# Altium project Pi4GPU_v1.PrjPcb (part 1 of 2)
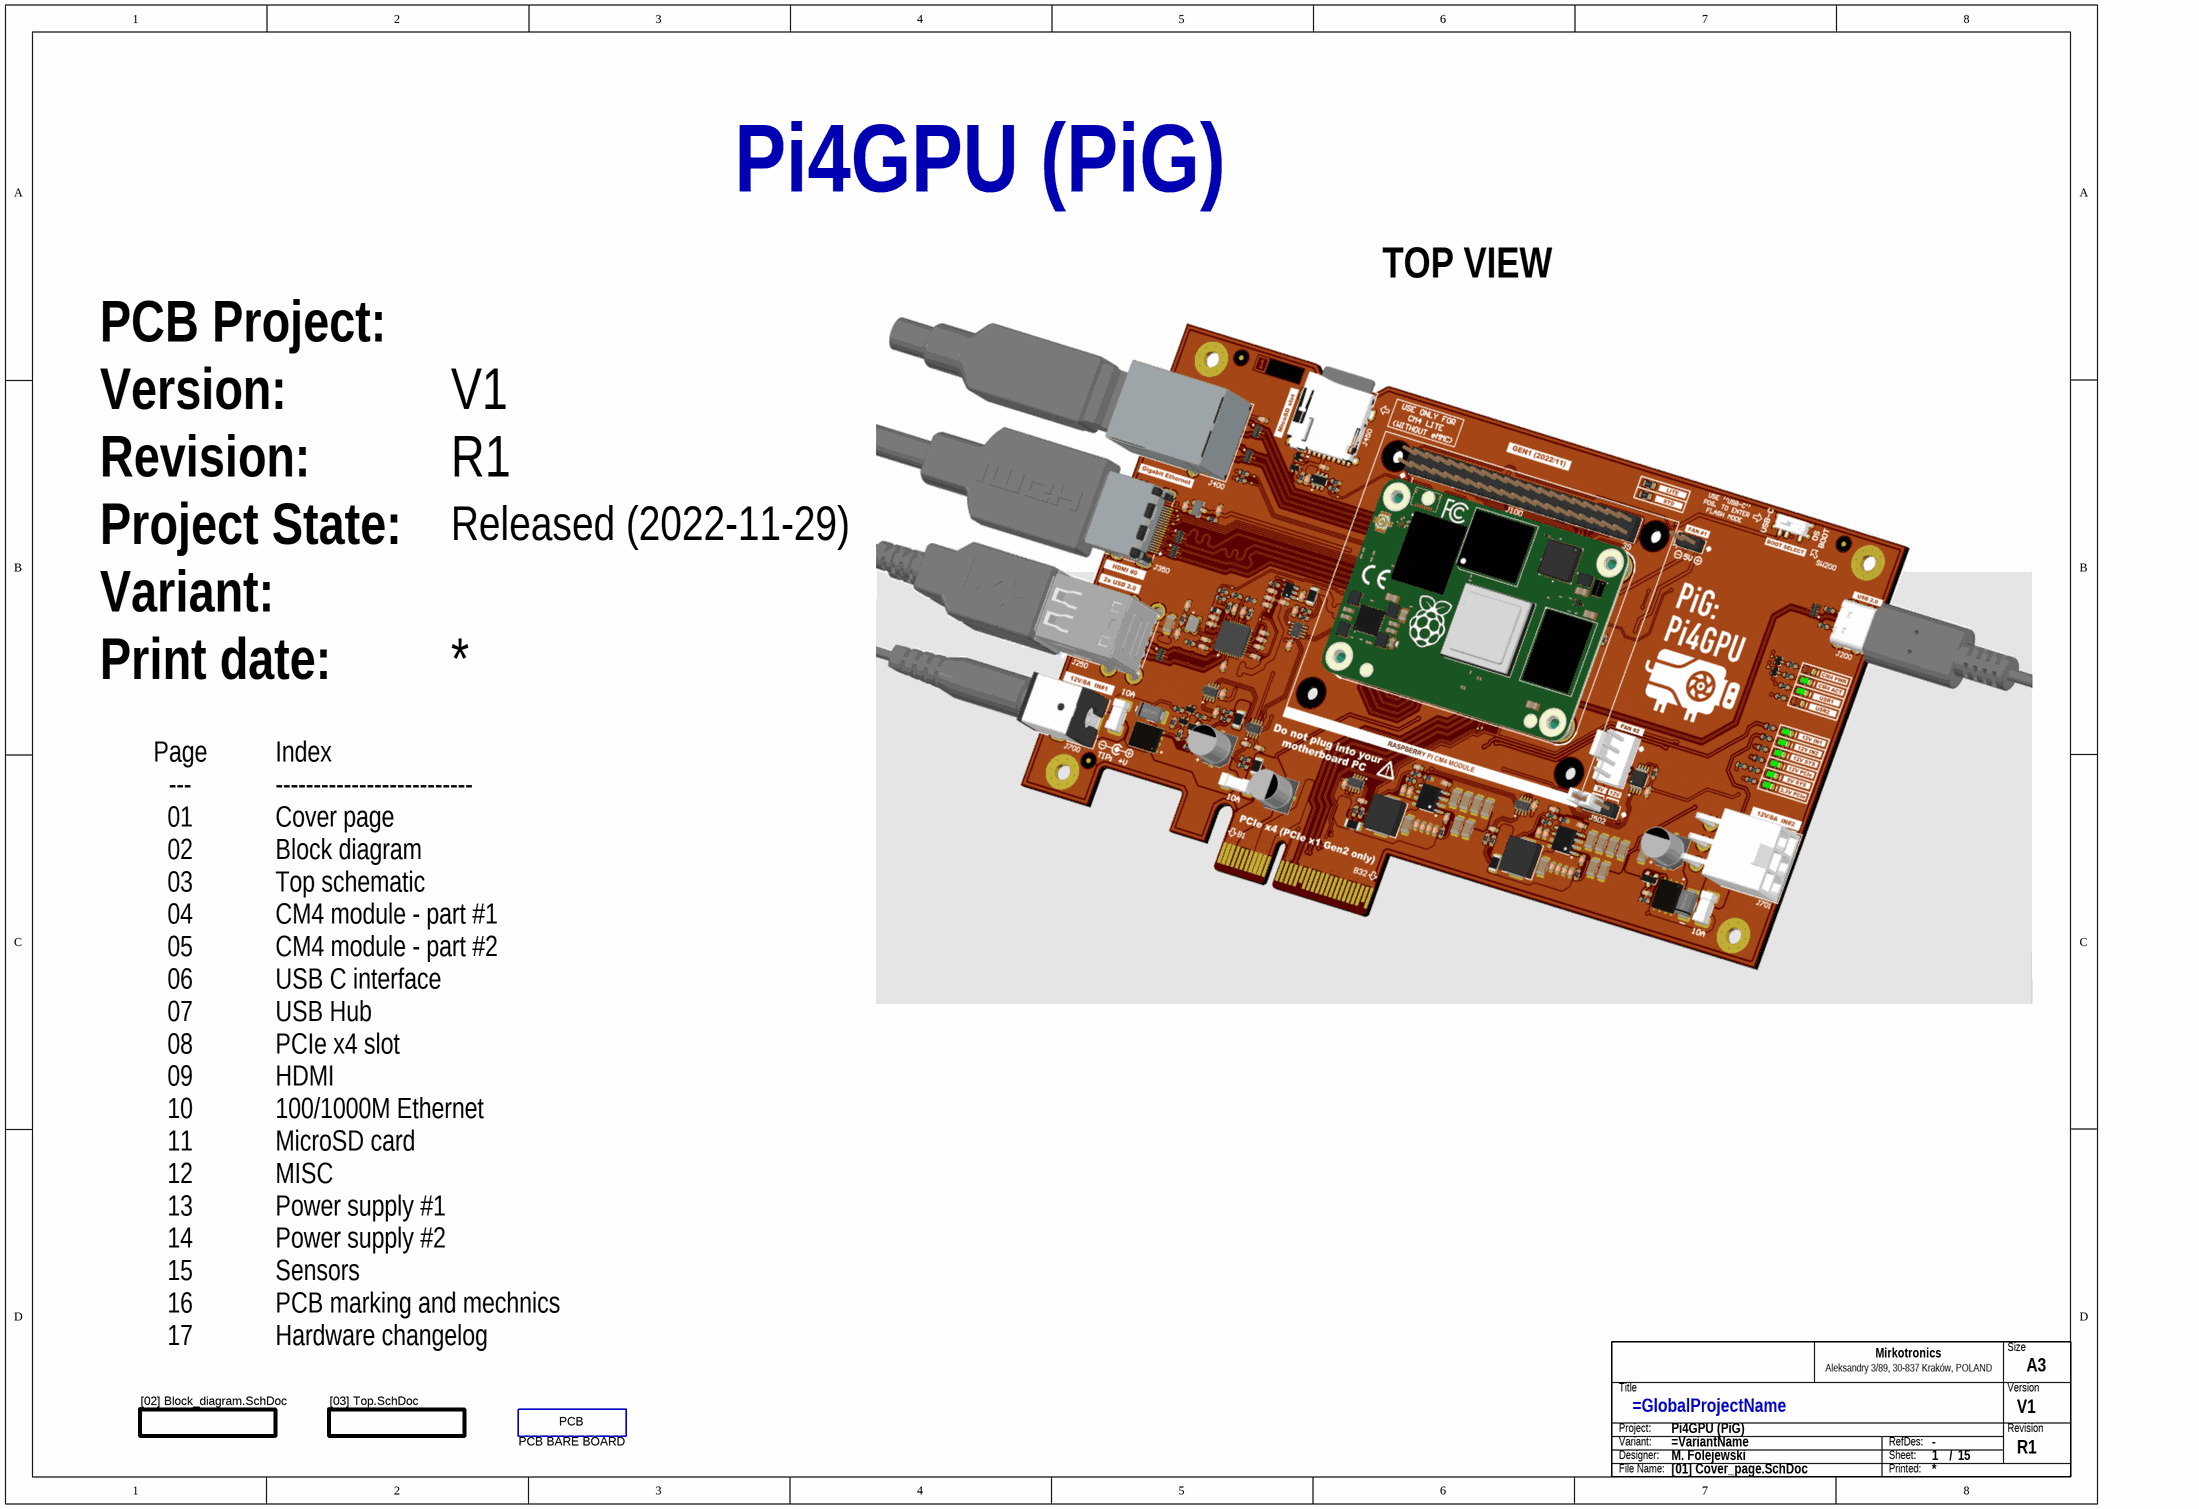
[diagram p0: [01] Cover_page.SchDoc]
GlobalProjectName: Pi4GPU (PiG); OutputFileNamePrefix: Pi4GPU_v1; PCBProjectName: Pi4GPU (PiG); SchPcbReleaseState: Released (2022-11-29); SchPcbRevision: R1; SchPcbVersion: V1
17 sheets, 308 parts. Net scope: global (net labels, ports and power ports of the same name join across sheets).
Board file: Pi4GPU_v1.PcbDoc
Sheets:
  [01] Cover_page.SchDoc
    D8 = [02] Block_diagram.SchDoc
    D9 = [03] TOP.SchDoc
      BLK1 = [04] CM4_PART1.SchDoc
      BLK2 = [05] CM4_PART2.SchDoc
      BLK4 = [08] PCIe.SchDoc
      BLK5 = [06] USB_C.SchDoc
      BLK4 = [10] Ethernet.SchDoc
      BLK4 = [11] SD.SchDoc
      BLK4 = [16] PCB_Mech.SchDoc
      BLK4 = [15] Sensors.SchDoc
      BLK4 = [17] Changelog.SchDoc
      BLK4 = [12] MISC.SchDoc
      BLK4 = [09] HDMI.SchDoc
      BLK4 = [07] USB_HUB.SchDoc
      BLK4 = [13] PWR1.SchDoc
      BLK5 = [14] PWR2.SchDoc

## Sheet [01] Cover_page.SchDoc: =GlobalProjectName
size A3; Engineer: M. Folejewski; DocumentNumber: 1; SheetNumber: 1; SheetTotal: 15; Designators: -; PageSize: A3

### Parts
(Parts that share a designator on the sheet are numbered #1, #2 ... from top to bottom, then left to right.)
PCB1  PCB BARE BOARD  (mechanical)
TB?#1  Title block  (value not drawn)  (graphical)

### Sub-sheets
D8 = [02] Block_diagram.SchDoc: no entries
D9 = [03] Top.SchDoc: no entries

### Notes on the sheet
- TOP VIEW
- PCB Project:
- Version:
- Revision:
- Project State:
- Variant:
- Print date:
- Page
  ---
  01
  02
  03
  04
  05
  06
  07
  08
  09
  10
  11
  12
  13
  14
  15
  16
  17
- Index
  --------------------------
  Cover page
  Block diagram
  Top schematic
  CM4 module - part #1
  CM4 module - part #2
  USB C interface
  USB Hub
  PCIe x4 slot
  HDMI
  100/1000M Ethernet
  MicroSD card
  MISC
  Power supply #1
  Power supply #2
  Sensors
  PCB marking and mechnics
  Hardware changelog
- (in symbol PCB_BARE_BOARD) PCB
- (in symbol SCH_TITLE_BLOCK_MIRKOTRONICS_V2) Size; Mirkotronics; Aleksandry 3/89, 30-837 Kraków, POLAND; Title; Version; Project:; Revision; Variant:; RefDes:; Designer:; Sheet:; /; File Name:; Printed:

### Library data of the parts
PCB1 = PCB_BARE_BOARD: Component Subtype: PCB Board; Component Type: PCB board; Manufacturer: -; MPN: N/A; Value: PCB BARE BOARD; Mounting Type: -; Supplier: ?
TB?#1 = SCH_TITLE_BLOCK_MIRKOTRONICS_V2: Component Type: Title block; Manufacturer: -; Mounting Type: Non component; MPN: -; Operating Temperature: -; Package: -; Specification: Title block; Value: Title block; Replacement: -; System: ?

## Sheet [02] Block_diagram.SchDoc: Block diagram
size A3; Engineer: M. Folejewski; DocumentNumber: 2; SheetNumber: 2; SheetTotal: 15; PageSize: A4; Designators: 1-99
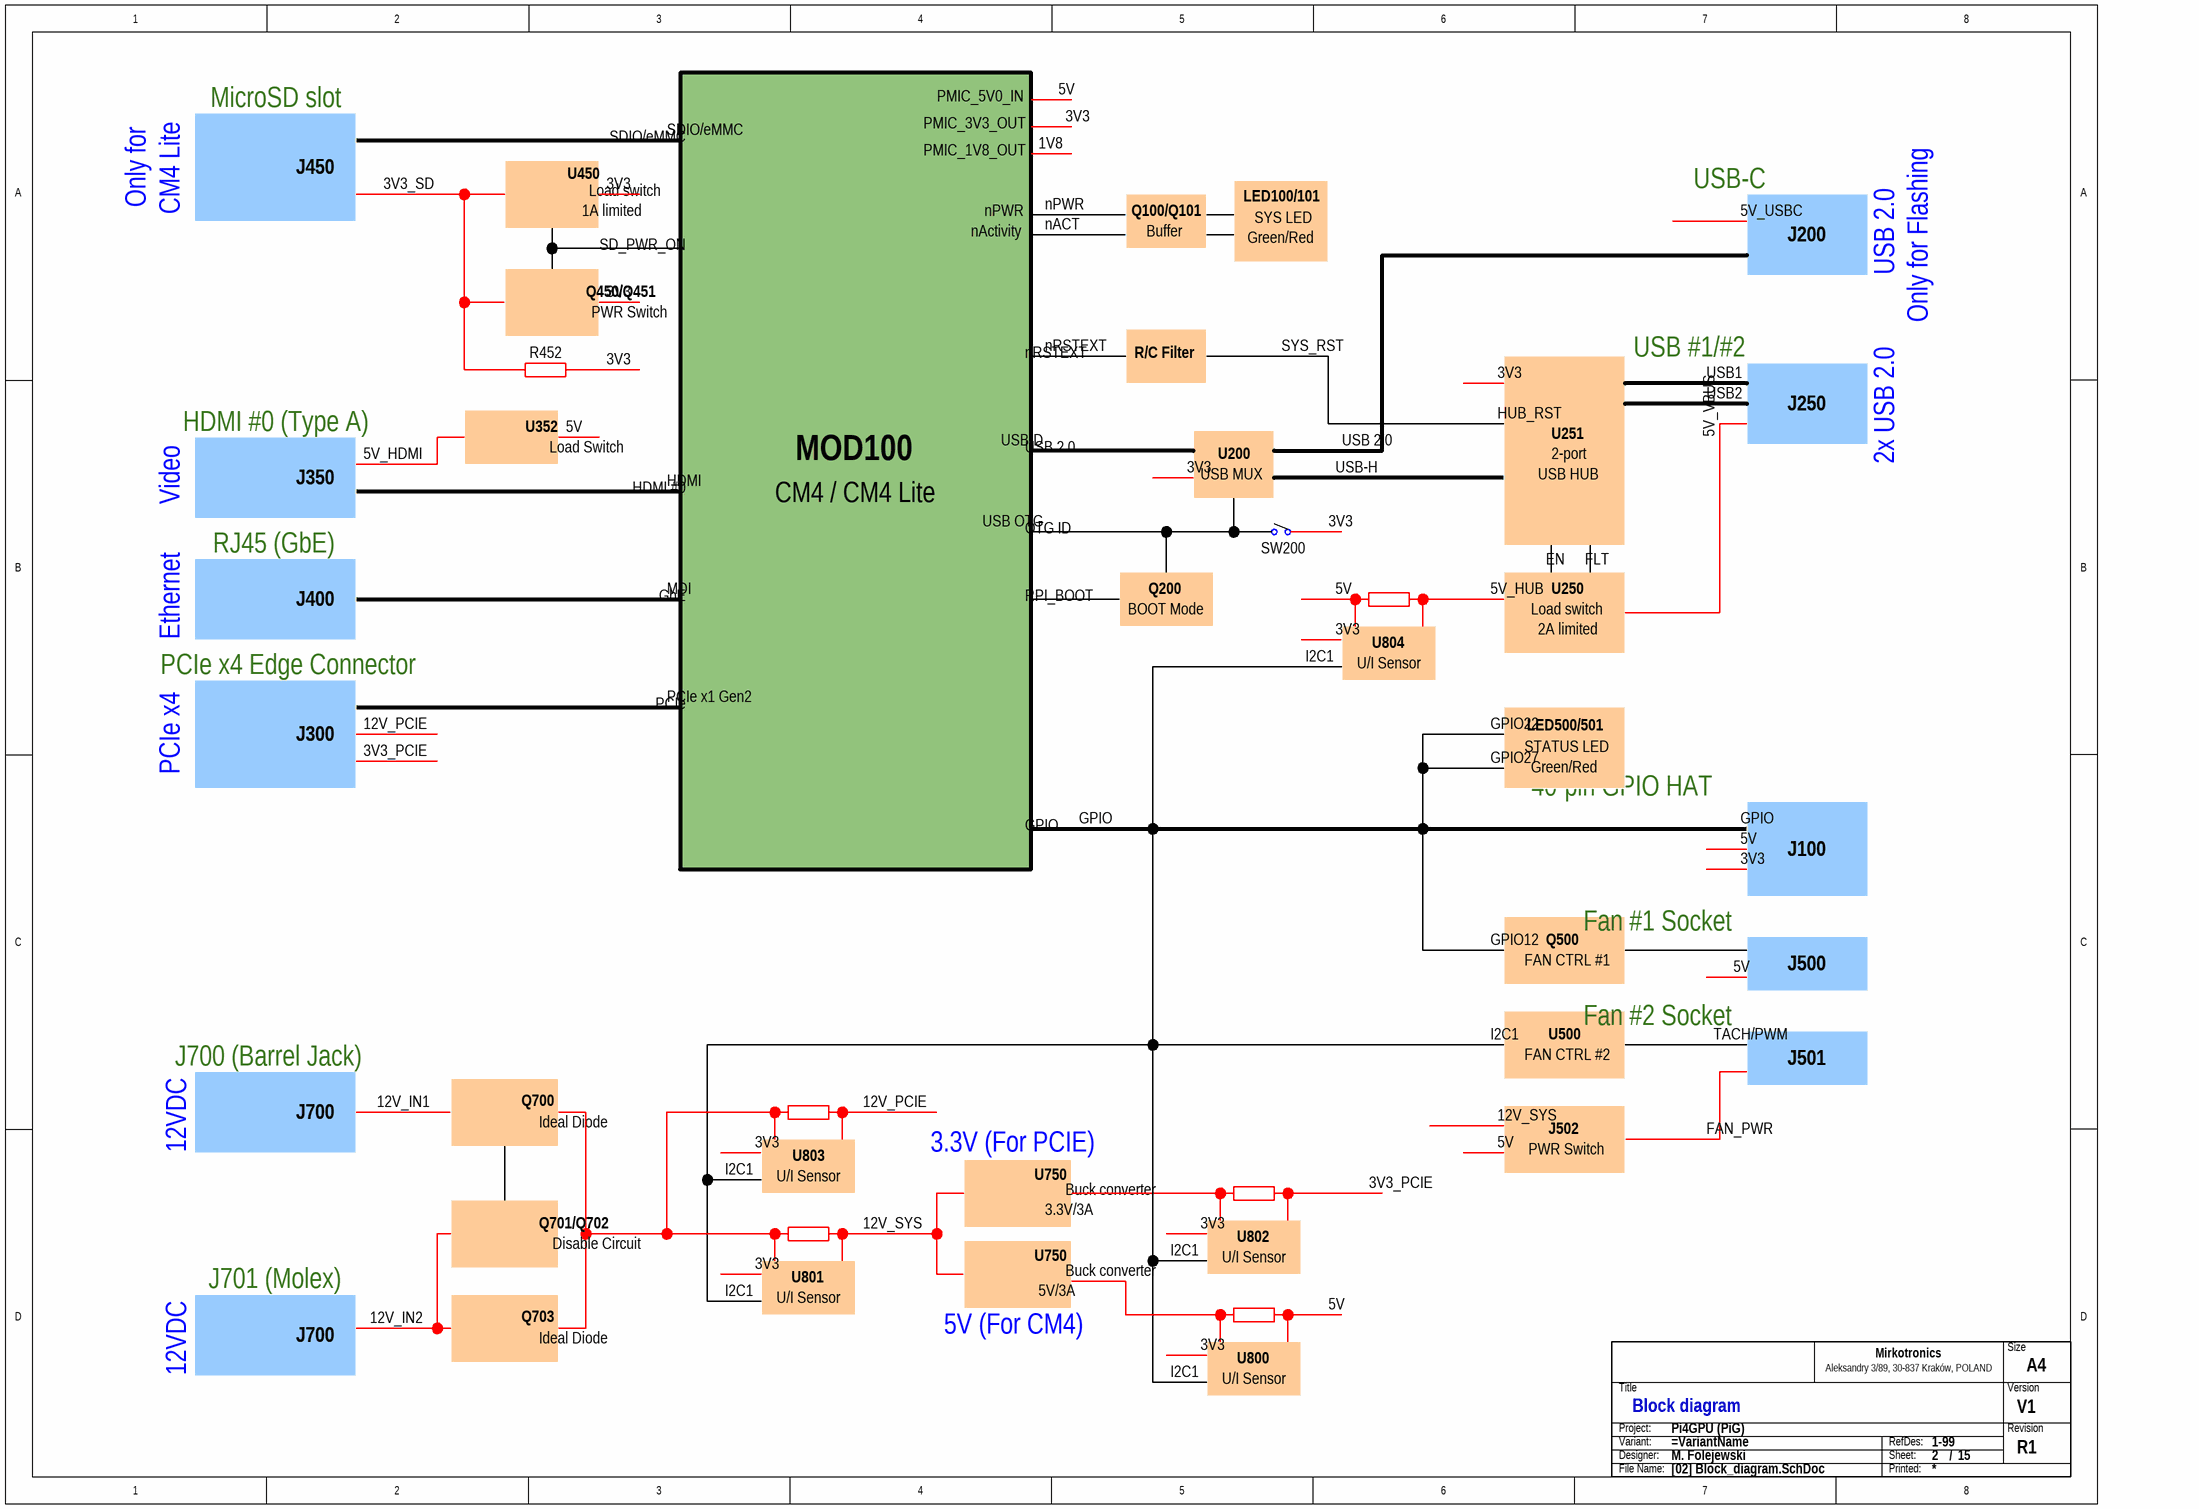
[diagram p1: [02] Block_diagram.SchDoc]

### Parts
(Parts that share a designator on the sheet are numbered #1, #2 ... from top to bottom, then left to right.)
TB?#2  Title block  (value not drawn)  (graphical)

### Notes on the sheet
- MicroSD slot
- PMIC_5V0_IN
- 5V
- J450
- U450
- SDIO/eMMC
- PMIC_3V3_OUT
- PMIC_1V8_OUT
- 1V8
- 3V3
- USB-C
- Only for
- CM4 Lite
- 3V3_SD
- 1A limited
- Load switch
- nActivity
- nPWR
- nACT
- Q100/Q101
- Buffer
- LED100/101
- Green/Red
- SYS LED
- 5V_USBC
- J200
- Q450/Q451
- PWR Switch
- SD_PWR_ON
- USB 2.0
- Only for Flashing
- R452
- nRSTEXT
- R/C Filter
- SYS_RST
- USB1
- USB #1/#2
- HDMI #0 (Type A)
- U352
- Load Switch
- USB-D
- HUB_RST
- U251
- USB2
- 5V_VBUS
- J250
- Video
- J350
- 5V_HDMI
- HDMI
- HDMI #0
- CM4 / CM4 Lite
- MOD100
- USB MUX
- U200
- USB-H
- USB HUB
- 2-port
- 2x USB 2.0
- RJ45 (GbE)
- OTG ID
- USB OTG
- SW200
- EN
- FLT
- Ethernet
- J400
- PCIe x4 Edge Connector
- MDI
- GbE
- RPI_BOOT
- BOOT Mode
- Q200
- U804
- 5V_HUB
- 2A limited
- U250
- PCIe x1 Gen2
- PCIe
- I2C1
- U/I Sensor
- PCIe x4
- J300
- 3V3_PCIE
- 12V_PCIE
- GPIO22
- GPIO27
- STATUS LED
- LED500/501
- 40-pin GPIO HAT
- GPIO
- J100
- Fan #1 Socket
- GPIO12
- FAN CTRL #1
- Q500
- Fan #2 Socket
- J500
- J700 (Barrel Jack)
- U500
- TACH/PWM
- J700
- 12V_IN1
- Q700
- Ideal Diode
- 12V_SYS
- FAN CTRL #2
- J501
- 12VDC
- U803
- 3.3V (For PCIE)
- U750
- J502
- FAN_PWR
- J701 (Molex)
- Q701/Q702
- Disable Circuit
- 3.3V/3A
- Buck converter
- U802
- 12V_IN2
- Q703
- U801
- 5V/3A
- 5V (For CM4)
- U800
- (in symbol SCH_TITLE_BLOCK_MIRKOTRONICS_V2) Size; Mirkotronics; Aleksandry 3/89, 30-837 Kraków, POLAND; Title; Version; Project:; Revision; Variant:; RefDes:; Designer:; Sheet:; /; File Name:; Printed:

### Library data of the parts
TB?#2 = SCH_TITLE_BLOCK_MIRKOTRONICS_V2: Component Type: Title block; Manufacturer: -; Mounting Type: Non component; MPN: -; Operating Temperature: -; Package: -; Specification: Title block; Value: Title block; Replacement: -; System: ?

## Sheet [03] TOP.SchDoc: Top schematic
size A4; Engineer: M. Folejewski; DocumentNumber: 3; SheetNumber: 3; SheetTotal: 15; PageSize: A4; Designators: 1-99
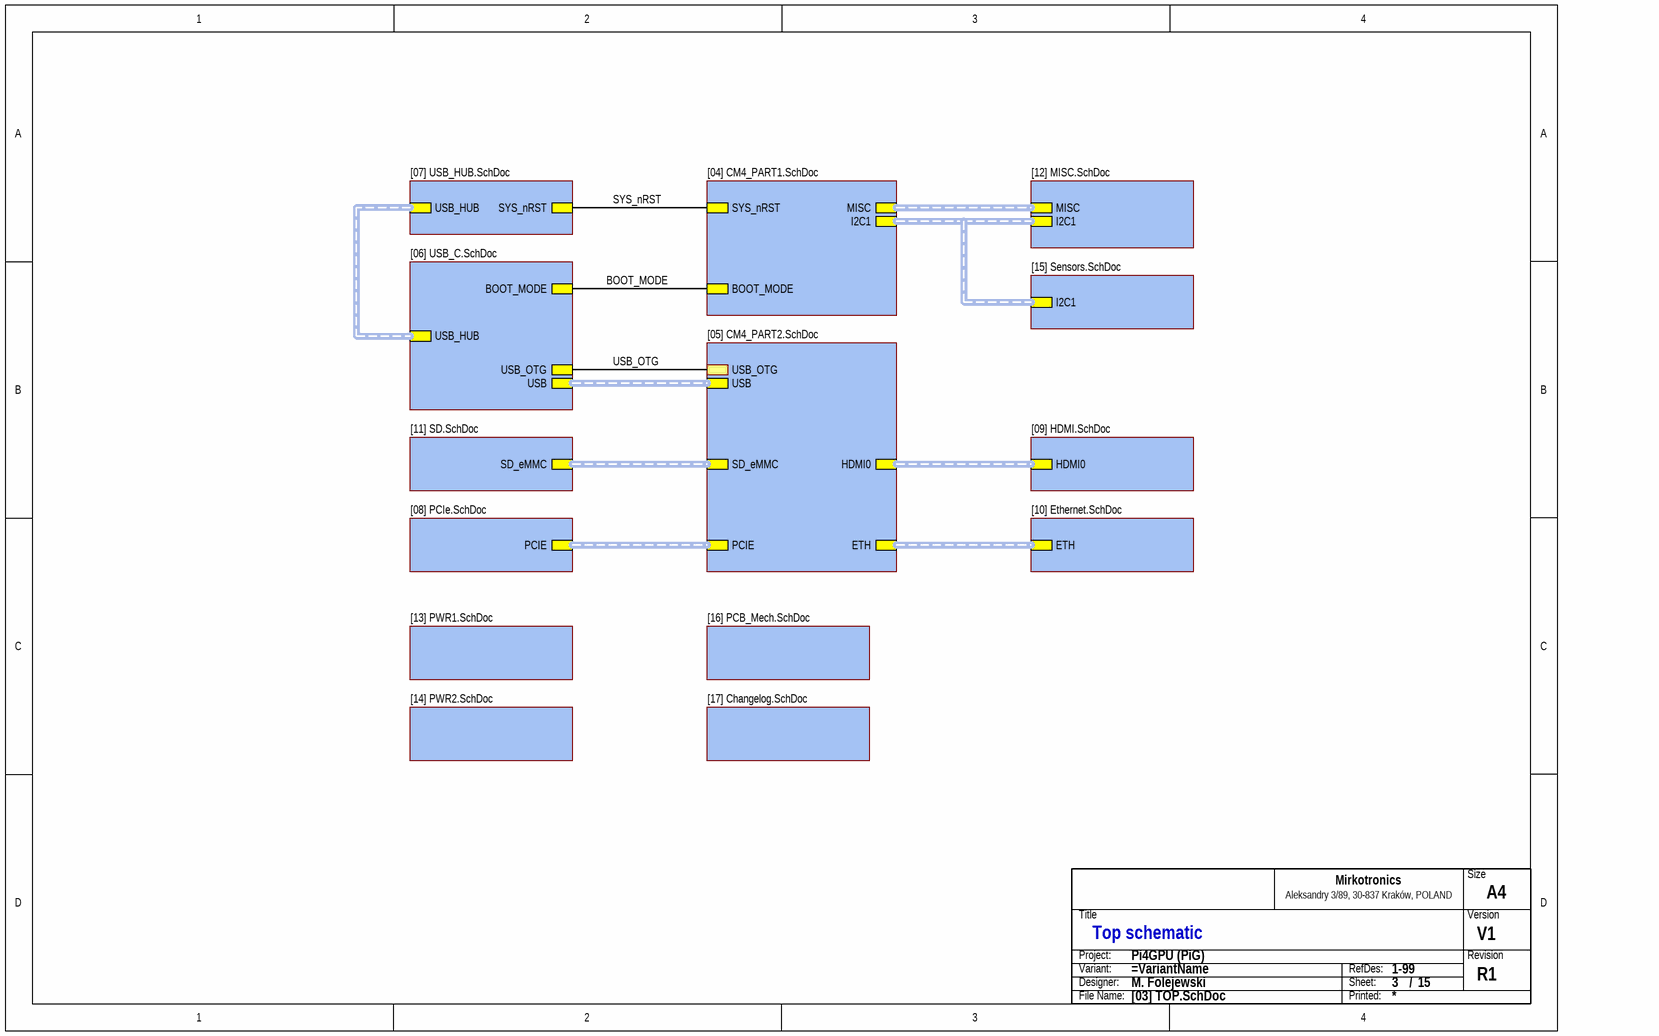
[diagram p2: [03] TOP.SchDoc]

### Parts
(Parts that share a designator on the sheet are numbered #1, #2 ... from top to bottom, then left to right.)
TB?#3  Title block  (value not drawn)  (graphical)

### Sub-sheets
BLK1 = [04] CM4_PART1.SchDoc: BOOT_MODE, MISC (harness MISC), SYS_nRST, I2C1 (harness I2C1)
BLK2 = [05] CM4_PART2.SchDoc: USB (harness USB), PCIE (harness PCIE), SD_eMMC (harness SD_eMMC), USB_OTG, ETH (harness ETH), HDMI0 (harness HDMI)
BLK4 = [08] PCIe.SchDoc: PCIE (harness PCIE)
BLK4 = [10] Ethernet.SchDoc: ETH (harness ETH)
BLK4 = [11] SD.SchDoc: SD_eMMC (harness SD_eMMC)
BLK4 = [16] PCB_Mech.SchDoc: no entries
BLK4 = [15] Sensors.SchDoc: I2C1 (harness I2C1)
BLK4 = [17] Changelog.SchDoc: no entries
BLK4 = [12] MISC.SchDoc: MISC (harness MISC), I2C1 (harness I2C1)
BLK4 = [09] HDMI.SchDoc: HDMI0 (harness HDMI)
BLK4 = [07] USB_HUB.SchDoc: USB_HUB (harness USB_HUB), SYS_nRST
BLK4 = [13] PWR1.SchDoc: no entries
BLK5 = [06] USB_C.SchDoc: USB (harness USB), BOOT_MODE, USB_OTG, USB_HUB (harness USB_HUB)
BLK5 = [14] PWR2.SchDoc: no entries

### Nets
BOOT_MODE: sheet BLK1/BOOT_MODE, sheet BLK5/BOOT_MODE
SYS_nRST: sheet BLK1/SYS_nRST, sheet BLK4/SYS_nRST
USB_OTG: sheet BLK2/USB_OTG, sheet BLK5/USB_OTG  [project net CM_USB_OTG]

### Buses and harness runs
harness sheet BLK1/I2C1 = sheet BLK4/I2C1
harness sheet BLK1/MISC = sheet BLK4/MISC
harness sheet BLK2/ETH = sheet BLK4/ETH
harness sheet BLK2/HDMI0 = sheet BLK4/HDMI0
harness sheet BLK2/PCIE = sheet BLK4/PCIE
harness sheet BLK2/SD_eMMC = sheet BLK4/SD_eMMC
harness sheet BLK2/USB = sheet BLK5/USB
harness sheet BLK4/USB_HUB = sheet BLK5/USB_HUB

### Notes on the sheet
- (in symbol SCH_TITLE_BLOCK_MIRKOTRONICS_V2) Size; Mirkotronics; Aleksandry 3/89, 30-837 Kraków, POLAND; Title; Version; Project:; Revision; Variant:; RefDes:; Designer:; Sheet:; /; File Name:; Printed:

### Library data of the parts
TB?#3 = SCH_TITLE_BLOCK_MIRKOTRONICS_V2: Component Type: Title block; Manufacturer: -; Mounting Type: Non component; MPN: -; Operating Temperature: -; Package: -; Specification: Title block; Value: Title block; Replacement: -; System: ?

## Sheet [04] CM4_PART1.SchDoc: Compute Module 4 (Part #1)
size A3; Engineer: M. Folejewski; DocumentNumber: 4; SheetNumber: 4; SheetTotal: 15; PageSize: A3; Designators: 100-199
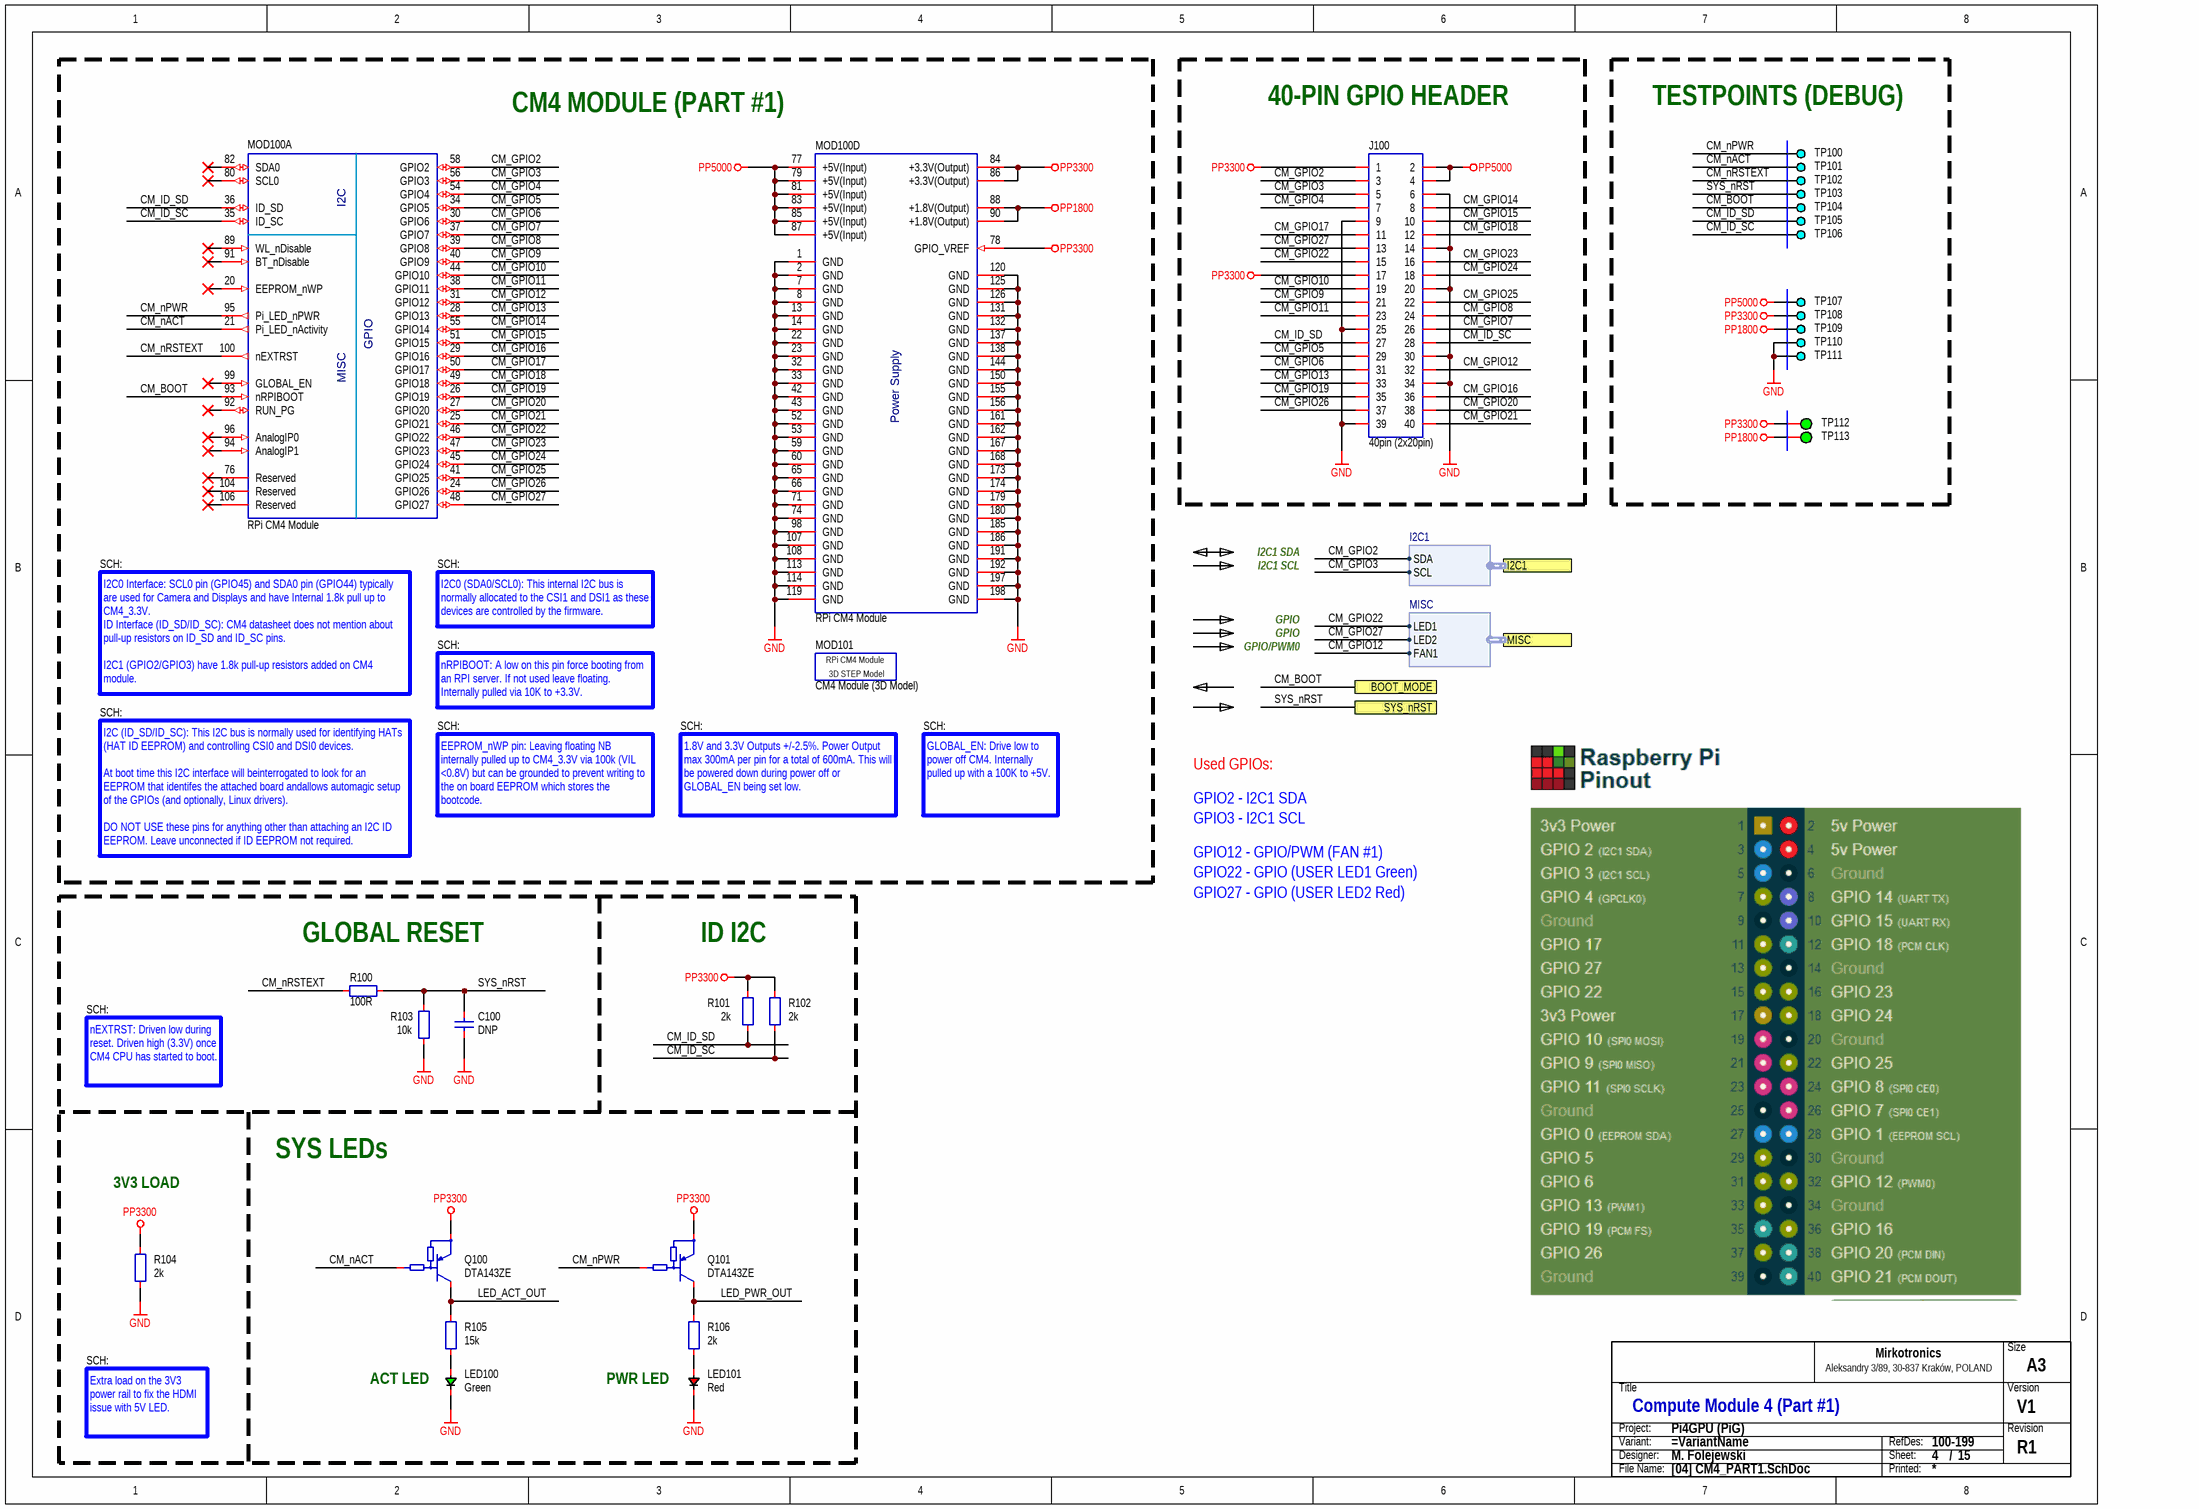
[diagram p3: [04] CM4_PART1.SchDoc]

### Parts
(Parts that share a designator on the sheet are numbered #1, #2 ... from top to bottom, then left to right.)
C100  DNP  [CAP_0603_R]
J100  40pin (2x20pin)  [CON_HDR_P254_2X20M_STR]
LED100  Green  [LED_0805_GRN_R]
LED101  Red  [LED_0805_RED_R]
MOD100  RPi CM4 Module  [MOD_RPI_CM4_SOCKET_P40_C300]  (parts A,D of 4)
MOD101  CM4 Module (3D Model)  [MOD_RPI_CM4_3D_C300_A1]  (no BOM)
Q100  DTA143ZE  [PKG_SOT523_SC75_SOT416_P100_R]
Q101  DTA143ZE  [PKG_SOT523_SC75_SOT416_P100_R]
R100  100R  [RES_0603_R]
R101  2k  [RES_0603_R]
R102  2k  [RES_0603_R]
R103  10k  [RES_0603_R]
R104  2k  [RES_0603_R]
R105  15k  [RES_0603_R]
R106  2k  [RES_0603_R]
TB?#4  Title block  (value not drawn)  (graphical)
TP100  DEBUG  [PCB_TP_DBG_50]  (value not drawn)  (no BOM)
TP101  DEBUG  [PCB_TP_DBG_50]  (value not drawn)  (no BOM)
TP102  DEBUG  [PCB_TP_DBG_50]  (value not drawn)  (no BOM)
TP103  DEBUG  [PCB_TP_DBG_50]  (value not drawn)  (no BOM)
TP104  DEBUG  [PCB_TP_DBG_50]  (value not drawn)  (no BOM)
TP105  DEBUG  [PCB_TP_DBG_50]  (value not drawn)  (no BOM)
TP106  DEBUG  [PCB_TP_DBG_50]  (value not drawn)  (no BOM)
TP107  DEBUG  [PCB_TP_DBG_50]  (value not drawn)  (no BOM)
TP108  DEBUG  [PCB_TP_DBG_50]  (value not drawn)  (no BOM)
TP109  DEBUG  [PCB_TP_DBG_50]  (value not drawn)  (no BOM)
TP110  DEBUG  [PCB_TP_DBG_50]  (value not drawn)  (no BOM)
TP111  DEBUG  [PCB_TP_DBG_50]  (value not drawn)  (no BOM)
TP112  ICT  [PCB_TP_ICT_100]  (value not drawn)  (no BOM)
TP113  ICT  [PCB_TP_ICT_100]  (value not drawn)  (no BOM)

### Ports
BOOT_MODE, I2C1 (harness I2C1), MISC (harness MISC), SYS_nRST

### Harnesses
MISC: LED1, LED2, FAN1
I2C1: SDA, SCL

### Nets
GND: C100.1 J100.6 J100.9 J100.14 J100.20 J100.25 J100.30 J100.34 J100.39 LED100.1 LED101.1 MOD100.1(GND) MOD100.2(GND) MOD100.7(GND) MOD100.8(GND) MOD100.13(GND) MOD100.14(GND) MOD100.22(GND) MOD100.23(GND) MOD100.32(GND) MOD100.33(GND) MOD100.42(GND) MOD100.43(GND) MOD100.52(GND) MOD100.53(GND) MOD100.59(GND) MOD100.60(GND) MOD100.65(GND) MOD100.66(GND) MOD100.71(GND) MOD100.74(GND) MOD100.98(GND) MOD100.107(GND) MOD100.108(GND) MOD100.113(GND) MOD100.114(GND) MOD100.119(GND) MOD100.120(GND) MOD100.125(GND) MOD100.126(GND) MOD100.131(GND) MOD100.132(GND) MOD100.137(GND) MOD100.138(GND) MOD100.144(GND) MOD100.150(GND) MOD100.155(GND) MOD100.156(GND) MOD100.161(GND) MOD100.162(GND) MOD100.167(GND) MOD100.168(GND) MOD100.173(GND) MOD100.174(GND) MOD100.179(GND) MOD100.180(GND) MOD100.185(GND) MOD100.186(GND) MOD100.191(GND) MOD100.192(GND) MOD100.197(GND) MOD100.198(GND) R103.1 R104.1 TP110.1 TP111.1
PP1800: MOD100.88(+1.8V(Output)) MOD100.90(+1.8V(Output)) TP109.1 TP113.1
PP3300: J100.1 J100.17 MOD100.78(GPIO_VREF) MOD100.84(+3.3V(Output)) MOD100.86(+3.3V(Output)) Q100.2(E) Q101.2(E) R101.2 R102.2 R104.2 TP108.1 TP112.1
PP5000: J100.2 J100.4 MOD100.77(+5V(Input)) MOD100.79(+5V(Input)) MOD100.81(+5V(Input)) MOD100.83(+5V(Input)) MOD100.85(+5V(Input)) MOD100.87(+5V(Input)) TP107.1
CM_BOOT: MOD100.93(nRPIBOOT) TP104.1 ; port BOOT_MODE  [project net BOOT_MODE]
CM_GPIO2: J100.3 MOD100.58(GPIO2) ; port I2C1.SDA
CM_GPIO3: J100.5 MOD100.56(GPIO3) ; port I2C1.SCL
CM_GPIO4: J100.7 MOD100.54(GPIO4)
CM_GPIO5: J100.29 MOD100.34(GPIO5)
CM_GPIO6: J100.31 MOD100.30(GPIO6)
CM_GPIO7: J100.26 MOD100.37(GPIO7)
CM_GPIO8: J100.24 MOD100.39(GPIO8)
CM_GPIO9: J100.21 MOD100.40(GPIO9)
CM_GPIO10: J100.19 MOD100.44(GPIO10)
CM_GPIO11: J100.23 MOD100.38(GPIO11)
CM_GPIO12: J100.32 MOD100.31(GPIO12) ; port MISC.FAN1
CM_GPIO13: J100.33 MOD100.28(GPIO13)
CM_GPIO14: J100.8 MOD100.55(GPIO14)
CM_GPIO15: J100.10 MOD100.51(GPIO15)
CM_GPIO16: J100.36 MOD100.29(GPIO16)
CM_GPIO17: J100.11 MOD100.50(GPIO17)
CM_GPIO18: J100.12 MOD100.49(GPIO18)
CM_GPIO19: J100.35 MOD100.26(GPIO19)
CM_GPIO20: J100.38 MOD100.27(GPIO20)
CM_GPIO21: J100.40 MOD100.25(GPIO21)
CM_GPIO22: J100.15 MOD100.46(GPIO22) ; port MISC.LED1
CM_GPIO23: J100.16 MOD100.47(GPIO23)
CM_GPIO24: J100.18 MOD100.45(GPIO24)
CM_GPIO25: J100.22 MOD100.41(GPIO25)
CM_GPIO26: J100.37 MOD100.24(GPIO26)
CM_GPIO27: J100.13 MOD100.48(GPIO27) ; port MISC.LED2
CM_ID_SC: J100.28 MOD100.35(ID_SC) R102.1 TP106.1
CM_ID_SD: J100.27 MOD100.36(ID_SD) R101.1 TP105.1
CM_nACT: MOD100.21(Pi_LED_nActivity) Q100.1(B) TP101.1
CM_nPWR: MOD100.95(Pi_LED_nPWR) Q101.1(B) TP100.1
CM_nRSTEXT: MOD100.100(nEXTRST) R100.1 TP102.1
LED_ACT_OUT: Q100.3(C) R105.2
LED_PWR_OUT: Q101.3(C) R106.2
SYS_nRST: C100.2 R100.2 R103.2 TP103.1 ; port SYS_nRST
NetLED100_2: LED100.2 R105.1
NetLED101_2: LED101.2 R106.1

Not connected (* = marked no-connect by the designer): MOD100 20(EEPROM_nWP)* 76(Reserved)* 80(SCL0)* 82(SDA0)* 89(WL_nDisable)* 91(BT_nDisable)* 92(RUN_PG)* 94(AnalogIP1)* 96(AnalogIP0)* 99(GLOBAL_EN)* 104(Reserved)* 106(Reserved)*

### Notes on the sheet
- 40-PIN GPIO HEADER
- TESTPOINTS (DEBUG)
- (near MOD100) CM4 MODULE (PART #1)
- SCH:
- I2C1 SDA
- I2C1 SCL
- I2C0 (SDA0/SCL0): This internal I2C bus is normally allocated to the CSI1 and DSI1 as these devices are controlled by the firmware.
- GPIO
- GPIO/PWM0
- I2C0 Interface: SCL0 pin (GPIO45) and SDA0 pin (GPIO44) typically are used for Camera and Displays and have Internal 1.8k pull up to CM4_3.3V.
  ID Interface (ID_SD/ID_SC): CM4 datasheet does not mention about pull-up resistors on ID_SD and ID_SC pins.
  I2C1 (GPIO2/GPIO3) have 1.8k pull-up resistors added on CM4 module.
- nRPIBOOT: A low on this pin force booting from an RPI server. If not used leave floating. Internally pulled via 10K to +3.3V.
- Used GPIOs:
- I2C (ID_SD/ID_SC): This I2C bus is normally used for identifying HATs (HAT ID EEPROM) and controlling CSI0 and DSI0 devices.
  At boot time this I2C interface will beinterrogated to look for an EEPROM that identifes the attached board andallows automagic setup of the GPIOs (and optionally, Linux drivers).
  DO NOT USE these pins for anything other than attaching an I2C ID EEPROM. Leave unconnected if ID EEPROM not required.
- EEPROM_nWP pin: Leaving floating NB internally pulled up to CM4_3.3V via 100k (VIL <0.8V) but can be grounded to prevent writing to the on board EEPROM which stores the bootcode.
- 1.8V and 3.3V Outputs +/-2.5%. Power Output max 300mA per pin for a total of 600mA. This will be powered down during power off or GLOBAL_EN being set low.
- GLOBAL_EN: Drive low to power off CM4. Internally pulled up with a 100K to +5V.
- GPIO2 - I2C1 SDA
- GPIO3 - I2C1 SCL
- GPIO12 - GPIO/PWM (FAN #1)
- GPIO22 - GPIO (USER LED1 Green)
- GPIO27 - GPIO (USER LED2 Red)
- GLOBAL RESET
- ID I2C
- nEXTRST: Driven low during reset. Driven high (3.3V) once CM4 CPU has started to boot.
- 3V3 LOAD
- SYS LEDs
- ACT LED
- PWR LED
- Extra load on the 3V3 power rail to fix the HDMI issue with 5V LED.
- (in symbol MOD_CM4_3D_MODEL) RPi CM4 Module
- (in symbol MOD_RPI_CM4_VAR2, part A) I2C; GPIO; MISC
- (in symbol MOD_RPI_CM4_VAR2, part D) Power Supply
- (in symbol SCH_TITLE_BLOCK_MIRKOTRONICS_V2) Size; Mirkotronics; Aleksandry 3/89, 30-837 Kraków, POLAND; Title; Version; Project:; Revision; Variant:; RefDes:; Designer:; Sheet:; /; File Name:; Printed:

### Library data of the parts
C100 = CAP-0018: Capacitor; MLCC; DNP; TBD; TBD; TBD; DO NOT PLACE; SMD; 0603 (1608);; Component Type: Capacitor; Component Subtype: MLCC; Value: DNP; Manufacturer: DNP; MPN: DNP; Mounting Type: SMD; Package (Case): 0603 (1608); Supplier: ?
J100 = CON_2X20_ROW: Connector; 2 Row;; Manufacturer: GENERIC; Component Subtype: Pin Header; MPN: GENERIC; Value: 40pin (2x20pin); Component Type: Connector; Mounting Type: THT; Supplier: ?
LED100 = DIO_LED_GRN: Diode; LED; Green;; Manufacturer: Foshan NationStar Optoelectronics; MPN: NCD0805G1; Component Subtype: LED Diode; Package (Case): 0805 (2012); Value: Green; Component Type: LED; Mounting Type: SMD; Supplier: LCSC
LED101 = DIO_LED_RED: Diode; LED; Red;; Manufacturer: Foshan NationStar Optoelectronics; MPN: NCD0805R1; Component Subtype: LED Diode; Package (Case): 0805 (2012); Value: Red; Component Type: LED; Mounting Type: SMD; Supplier: LCSC
MOD100 = MOD_RPI_CM4_VAR2: PCB Module; RPi Compute Module 4;; Manufacturer: Raspberry Pi Foundation; Component Subtype: Raspberry Pi CM4; MPN: CM4 Module; Value: RPi CM4 Module; Component Type: PCB Module; Mounting Type: -; Supplier: ?
MOD101 = MOD_CM4_3D_MODEL: PCB Module; RPi Compute Module 4; 3D model; Component Subtype: 3D STEP Model; Component Type: PCB Module; Manufacturer: -; Mounting Type: -; MPN: -; Package (Case): -; Supplier: -; Value: CM4 Module (3D Model)
Q100 Q101 = TRA_BJT_PNP_DIG_ONS_DTA143ZE: Transistor; BJT; PNP; Digital (Biased);; Manufacturer: On Semiconductor; MPN: DTA143ZET1G; Component Type: Transistor; Mounting Type: SMD; Value: DTA143ZE
R100 = RES-0026: Resistor; Thick Film; 100R; 1%; 100mW; 100PPM; 75V; Standard; SMD; 0603 (1608);; Manufacturer: Yageo Corporation; MPN: TBD; Component Type: Resistor; Component Subtype: Thick Film; Value: 100R; Mounting Type: SMD; Package (Case): 0603 (1608); Supplier: ?
R101 R102 R104 R106 = RES-0033: Resistor; Thick Film; 2k2; 1%; 100mW; 100PPM; 75V; Standard; SMD; 0603 (1608);; Manufacturer: Yageo Corporation; MPN: TBD; Component Type: Resistor; Component Subtype: Thick Film; Value: 2k; Mounting Type: SMD; Package (Case): 0603 (1608); Supplier: ?
R103 = RES-0028: Resistor; Thick Film; 10k; 1%; 100mW; 100PPM; 75V; Standard; SMD; 0603 (1608);; Manufacturer: Yageo Corporation; MPN: RC0603FR-0710KL; Component Type: Resistor; Component Subtype: Thick Film; Value: 10k; Mounting Type: SMD; Package (Case): 0603 (1608); Supplier: ?
R105 = RES-0043: Resistor; Thick Film; 15k; 1%; 100mW; 100PPM; 75V; Standard; SMD; 0603 (1608);; Manufacturer: Yageo Corporation; MPN: TBD; Component Type: Resistor; Component Subtype: Thick Film; Value: 15k; Mounting Type: SMD; Package (Case): 0603 (1608); Supplier: ?
TB?#4 = SCH_TITLE_BLOCK_MIRKOTRONICS_V2: Component Type: Title block; Manufacturer: -; Mounting Type: Non component; MPN: -; Operating Temperature: -; Package: -; Specification: Title block; Value: Title block; Replacement: -; System: ?
TP100-TP111 = PCB_TP_DBG: PCB Marking; Test Point (Debug);; Value: DEBUG; Component Subtype: -; Component Type: Testpoint; Mounting Type: -; Supplier: ?
TP112 TP113 = PCB_TP_ICT: Test Point (ICT); Specification: Testpoint (for ICT), SMD pad; Component Type: Testpoint (for ICT); Manufacturer: -; Mounting Type: Non component; MPN: -; Value: ICT

## Sheet [05] CM4_PART2.SchDoc: Compute Module 4 (Part #2)
size B; Engineer: M. Folejewski; DocumentNumber: 5; SheetNumber: 5; SheetTotal: 15; PageSize: B; Designators: 100-199
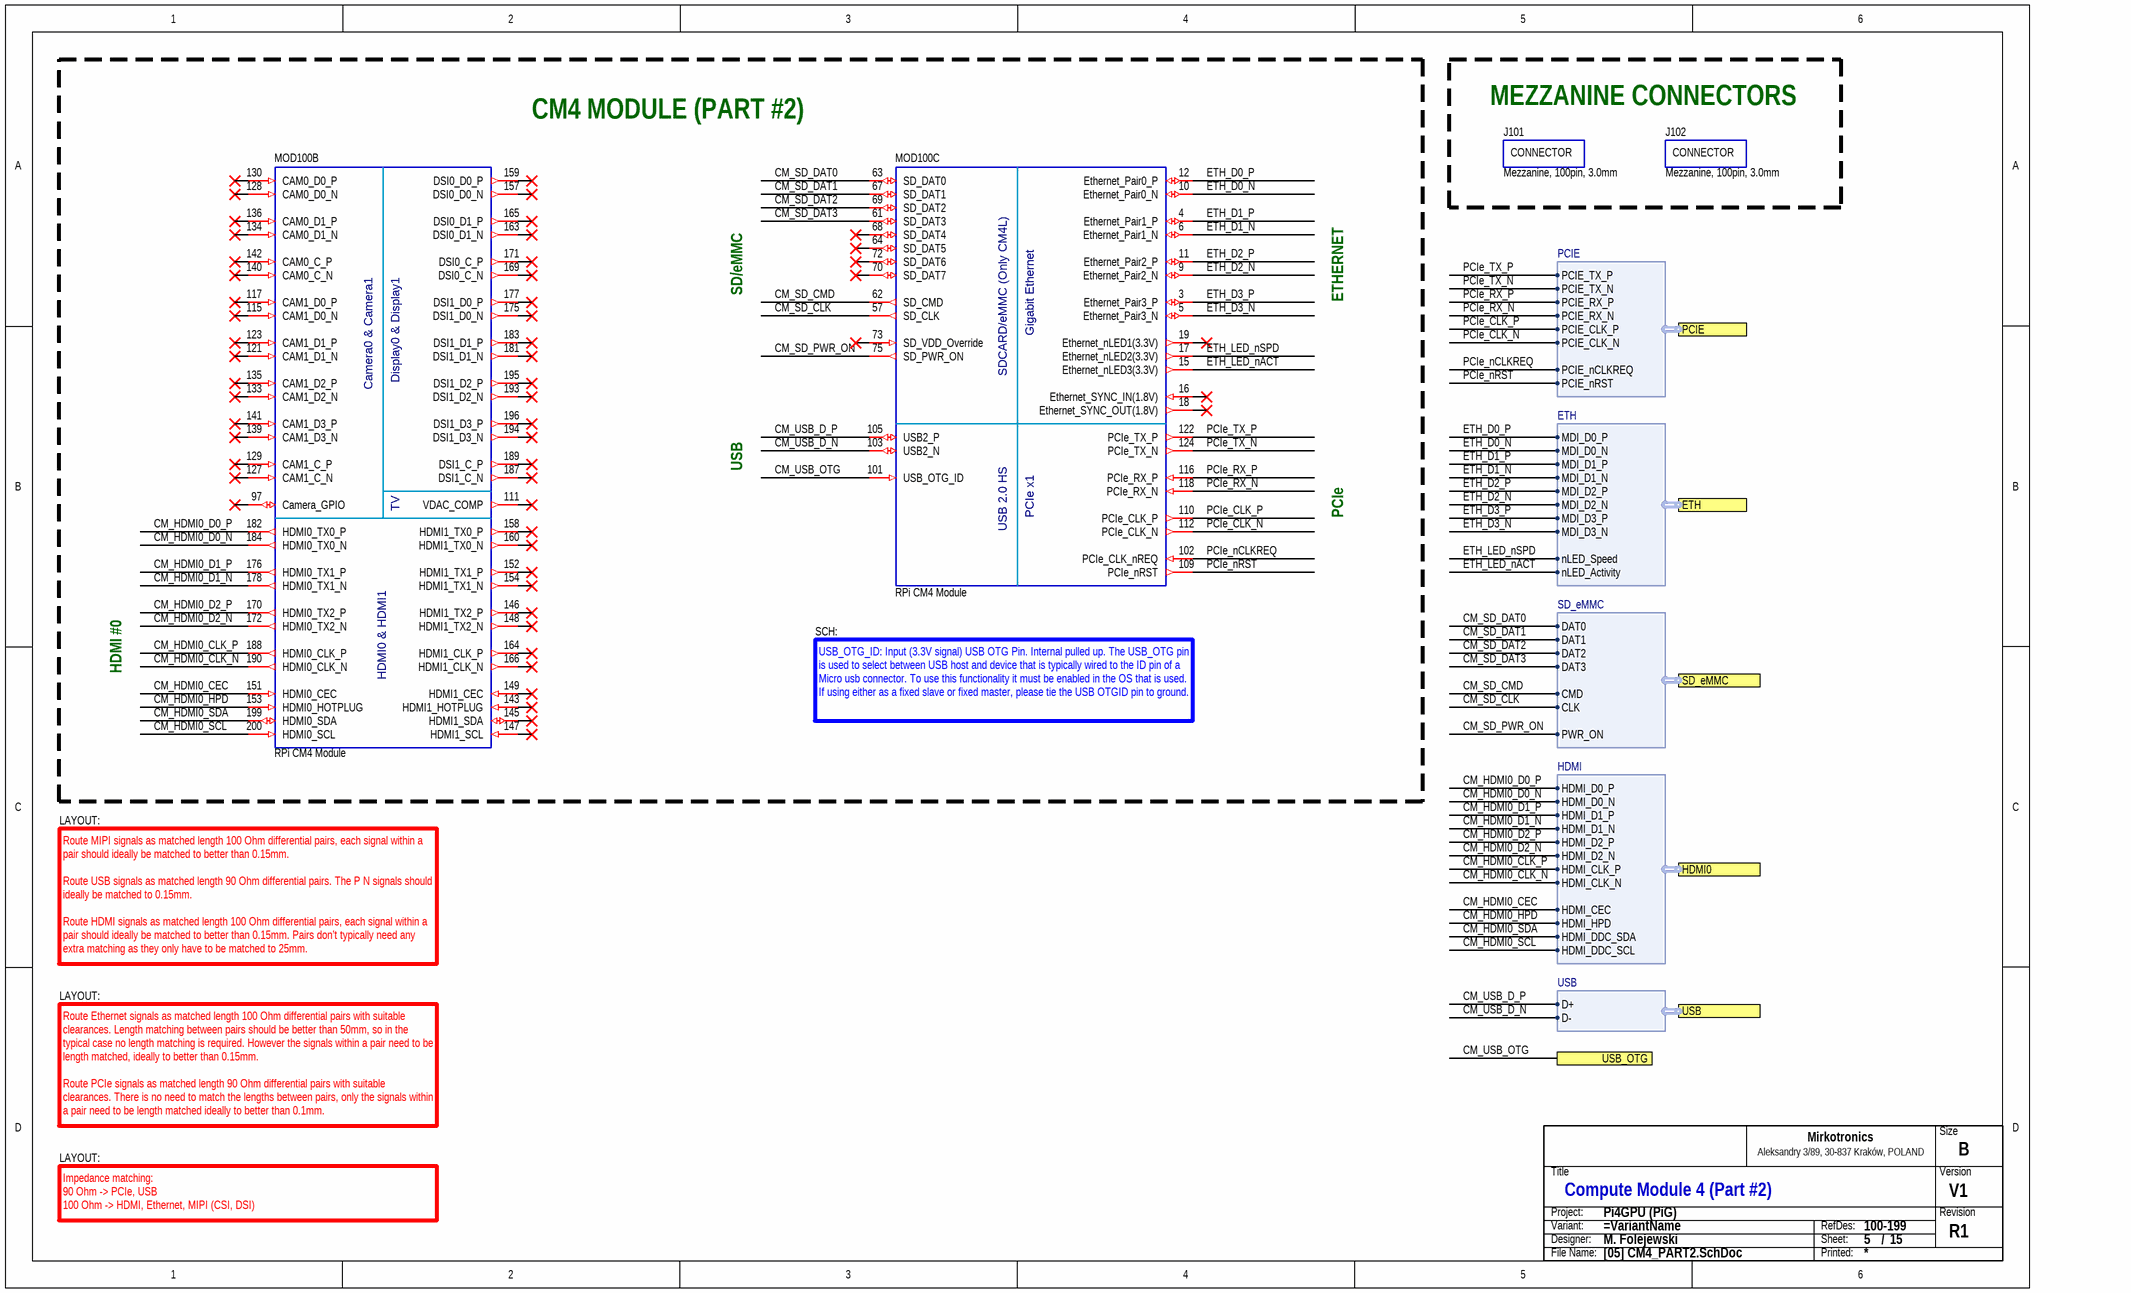
[diagram p4: [05] CM4_PART2.SchDoc]

### Parts
(Parts that share a designator on the sheet are numbered #1, #2 ... from top to bottom, then left to right.)
J101  Mezzanine, 100pin, 3.0mm  [PCB_BLANK_COMP_SMD]
J102  Mezzanine, 100pin, 3.0mm  [PCB_BLANK_COMP_SMD]
MOD100  RPi CM4 Module  [MOD_RPI_CM4_SOCKET_P40_C300]  (parts B,C of 4)
TB?#5  Title block  (value not drawn)  (graphical)

### Ports
ETH (harness ETH), HDMI0 (harness HDMI), PCIE (harness PCIE), SD_eMMC (harness SD_eMMC), USB (harness USB), USB_OTG

### Harnesses
SD_eMMC: DAT0, DAT1, DAT2, DAT3, CMD, CLK, PWR_ON
USB: D+, D-
ETH: MDI_D0_P, MDI_D0_N, MDI_D1_P, MDI_D1_N, MDI_D2_P, MDI_D2_N, MDI_D3_P, MDI_D3_N, nLED_Speed, nLED_Activity
PCIE: PCIE_TX_P, PCIE_TX_N, PCIE_RX_P, PCIE_RX_N, PCIE_CLK_P, PCIE_CLK_N, PCIE_nCLKREQ, PCIE_nRST
HDMI: HDMI_D0_P, HDMI_D0_N, HDMI_D1_P, HDMI_D1_N, HDMI_CEC, HDMI_DDC_SDA, HDMI_D2_P, HDMI_D2_N, HDMI_CLK_P, HDMI_CLK_N, HDMI_DDC_SCL, HDMI_HPD

### Nets
CM_HDMI0_CEC: MOD100.151(HDMI0_CEC) ; port HDMI0.HDMI_CEC
CM_HDMI0_CLK_N: MOD100.190(HDMI0_CLK_N) ; port HDMI0.HDMI_CLK_N
CM_HDMI0_CLK_P: MOD100.188(HDMI0_CLK_P) ; port HDMI0.HDMI_CLK_P
CM_HDMI0_D0_N: MOD100.184(HDMI0_TX0_N) ; port HDMI0.HDMI_D0_N
CM_HDMI0_D0_P: MOD100.182(HDMI0_TX0_P) ; port HDMI0.HDMI_D0_P
CM_HDMI0_D1_N: MOD100.178(HDMI0_TX1_N) ; port HDMI0.HDMI_D1_N
CM_HDMI0_D1_P: MOD100.176(HDMI0_TX1_P) ; port HDMI0.HDMI_D1_P
CM_HDMI0_D2_N: MOD100.172(HDMI0_TX2_N) ; port HDMI0.HDMI_D2_N
CM_HDMI0_D2_P: MOD100.170(HDMI0_TX2_P) ; port HDMI0.HDMI_D2_P
CM_HDMI0_HPD: MOD100.153(HDMI0_HOTPLUG) ; port HDMI0.HDMI_HPD
CM_HDMI0_SCL: MOD100.200(HDMI0_SCL) ; port HDMI0.HDMI_DDC_SCL
CM_HDMI0_SDA: MOD100.199(HDMI0_SDA) ; port HDMI0.HDMI_DDC_SDA
CM_SD_CLK: MOD100.57(SD_CLK) ; port SD_eMMC.CLK
CM_SD_CMD: MOD100.62(SD_CMD) ; port SD_eMMC.CMD
CM_SD_DAT0: MOD100.63(SD_DAT0) ; port SD_eMMC.DAT0
CM_SD_DAT1: MOD100.67(SD_DAT1) ; port SD_eMMC.DAT1
CM_SD_DAT2: MOD100.69(SD_DAT2) ; port SD_eMMC.DAT2
CM_SD_DAT3: MOD100.61(SD_DAT3) ; port SD_eMMC.DAT3
CM_SD_PWR_ON: MOD100.75(SD_PWR_ON) ; port SD_eMMC.PWR_ON
CM_USB_D_N: MOD100.103(USB2_N) ; port USB.D-
CM_USB_D_P: MOD100.105(USB2_P) ; port USB.D+
CM_USB_OTG: MOD100.101(USB_OTG_ID) ; port USB_OTG
ETH_D0_N: MOD100.10(Ethernet_Pair0_N) ; port ETH.MDI_D0_N
ETH_D0_P: MOD100.12(Ethernet_Pair0_P) ; port ETH.MDI_D0_P
ETH_D1_N: MOD100.6(Ethernet_Pair1_N) ; port ETH.MDI_D1_N
ETH_D1_P: MOD100.4(Ethernet_Pair1_P) ; port ETH.MDI_D1_P
ETH_D2_N: MOD100.9(Ethernet_Pair2_N) ; port ETH.MDI_D2_N
ETH_D2_P: MOD100.11(Ethernet_Pair2_P) ; port ETH.MDI_D2_P
ETH_D3_N: MOD100.5(Ethernet_Pair3_N) ; port ETH.MDI_D3_N
ETH_D3_P: MOD100.3(Ethernet_Pair3_P) ; port ETH.MDI_D3_P
ETH_LED_nACT: MOD100.15(Ethernet_nLED3(3.3V)) ; port ETH.nLED_Activity
ETH_LED_nSPD: MOD100.17(Ethernet_nLED2(3.3V)) ; port ETH.nLED_Speed
PCIe_CLK_N: MOD100.112(PCIe_CLK_N) ; port PCIE.PCIE_CLK_N
PCIe_CLK_P: MOD100.110(PCIe_CLK_P) ; port PCIE.PCIE_CLK_P
PCIe_nCLKREQ: MOD100.102(PCIe_CLK_nREQ) ; port PCIE.PCIE_nCLKREQ
PCIe_nRST: MOD100.109(PCIe_nRST) ; port PCIE.PCIE_nRST
PCIe_RX_N: MOD100.118(PCIe_RX_N) ; port PCIE.PCIE_RX_N
PCIe_RX_P: MOD100.116(PCIe_RX_P) ; port PCIE.PCIE_RX_P
PCIe_TX_N: MOD100.124(PCIe_TX_N) ; port PCIE.PCIE_TX_N
PCIe_TX_P: MOD100.122(PCIe_TX_P) ; port PCIE.PCIE_TX_P

Not connected (* = marked no-connect by the designer): MOD100 16(Ethernet_SYNC_IN(1.8V))* 18(Ethernet_SYNC_OUT(1.8V))* 19(Ethernet_nLED1(3.3V))* 64(SD_DAT5)* 68(SD_DAT4)* 70(SD_DAT7)* 72(SD_DAT6)* 73(SD_VDD_Override)* 97(Camera_GPIO)* 111(VDAC_COMP)* 115(CAM1_D0_N)* 117(CAM1_D0_P)* 121(CAM1_D1_N)* 123(CAM1_D1_P)* 127(CAM1_C_N)* 128(CAM0_D0_N)* 129(CAM1_C_P)* 130(CAM0_D0_P)* 133(CAM1_D2_N)* 134(CAM0_D1_N)* 135(CAM1_D2_P)* 136(CAM0_D1_P)* 139(CAM1_D3_N)* 140(CAM0_C_N)* 141(CAM1_D3_P)* 142(CAM0_C_P)* 143(HDMI1_HOTPLUG)* 145(HDMI1_SDA)* 146(HDMI1_TX2_P)* 147(HDMI1_SCL)* 148(HDMI1_TX2_N)* 149(HDMI1_CEC)* 152(HDMI1_TX1_P)* 154(HDMI1_TX1_N)* 157(DSI0_D0_N)* 158(HDMI1_TX0_P)* 159(DSI0_D0_P)* 160(HDMI1_TX0_N)* 163(DSI0_D1_N)* 164(HDMI1_CLK_P)* 165(DSI0_D1_P)* 166(HDMI1_CLK_N)* 169(DSI0_C_N)* 171(DSI0_C_P)* 175(DSI1_D0_N)* 177(DSI1_D0_P)* 181(DSI1_D1_N)* 183(DSI1_D1_P)* 187(DSI1_C_N)* 189(DSI1_C_P)* 193(DSI1_D2_N)* 194(DSI1_D3_N)* 195(DSI1_D2_P)* 196(DSI1_D3_P)*

### Notes on the sheet
- CM4 MODULE (PART #2)
- MEZZANINE CONNECTORS
- SD/eMMC
- ETHERNET
- USB
- PCIe
- SCH:
- HDMI #0
- USB_OTG_ID: Input (3.3V signal) USB OTG Pin. Internal pulled up. The USB_OTG pin is used to select between USB host and device that is typically wired to the ID pin of a Micro usb connector. To use this functionality it must be enabled in the OS that is used. If using either as a fixed slave or fixed master, please tie the USB OTGID pin to ground.
- LAYOUT:
- Route MIPI signals as matched length 100 Ohm differential pairs, each signal within a pair should ideally be matched to better than 0.15mm.
  Route USB signals as matched length 90 Ohm differential pairs. The P N signals should ideally be matched to 0.15mm.
  Route HDMI signals as matched length 100 Ohm differential pairs, each signal within a pair should ideally be matched to better than 0.15mm. Pairs don’t typically need any extra matching as they only have to be matched to 25mm.
- Route Ethernet signals as matched length 100 Ohm differential pairs with suitable clearances. Length matching between pairs should be better than 50mm, so in the typical case no length matching is required. However the signals within a pair need to be length matched, ideally to better than 0.15mm.
  Route PCIe signals as matched length 90 Ohm differential pairs with suitable clearances. There is no need to match the lengths between pairs, only the signals within a pair need to be length matched ideally to better than 0.1mm.
- Impedance matching:
  90 Ohm -> PCIe, USB
  100 Ohm -> HDMI, Ethernet, MIPI (CSI, DSI)
- (in symbol BOM_CON) CONNECTOR
- (in symbol MOD_RPI_CM4_VAR2, part B) Display0 & Display1; Camera0 & Camera1; TV; HDMI0 & HDMI1
- (in symbol MOD_RPI_CM4_VAR2, part C) Gigabit Ethernet; SDCARD/eMMC (Only CM4L); PCIe x1; USB 2.0 HS
- (in symbol SCH_TITLE_BLOCK_MIRKOTRONICS_V2) Size; Mirkotronics; Aleksandry 3/89, 30-837 Kraków, POLAND; Title; Version; Project:; Revision; Variant:; RefDes:; Designer:; Sheet:; /; File Name:; Printed:

### Library data of the parts
J101 J102 = BOM_CON: BOM list; Connector;; Manufacturer: Hirose; MPN: DF40HC(3.0)-100DS-0.4V; Component Subtype: Microminiature; Package (Case): SMD; Value: Mezzanine, 100pin, 3.0mm; Component Type: Connector; Mounting Type: SMD; Supplier: ?
MOD100 = MOD_RPI_CM4_VAR2: as MOD100 on sheet [04] CM4_PART1; Value: RPi CM4 Module; MPN: CM4 Module; Component Type: PCB Module; Mounting Type: -; Supplier: ?
TB?#5 = SCH_TITLE_BLOCK_MIRKOTRONICS_V2: Component Type: Title block; Manufacturer: -; Mounting Type: Non component; MPN: -; Operating Temperature: -; Package: -; Specification: Title block; Value: Title block; Replacement: -; System: ?

## Sheet [08] PCIe.SchDoc: PCIe x4 edge connector (PCIe x1 only)
size A4; Engineer: M. Folejewski; DocumentNumber: 8; SheetNumber: 8; SheetTotal: 15; PageSize: A4; Designators: 300-399
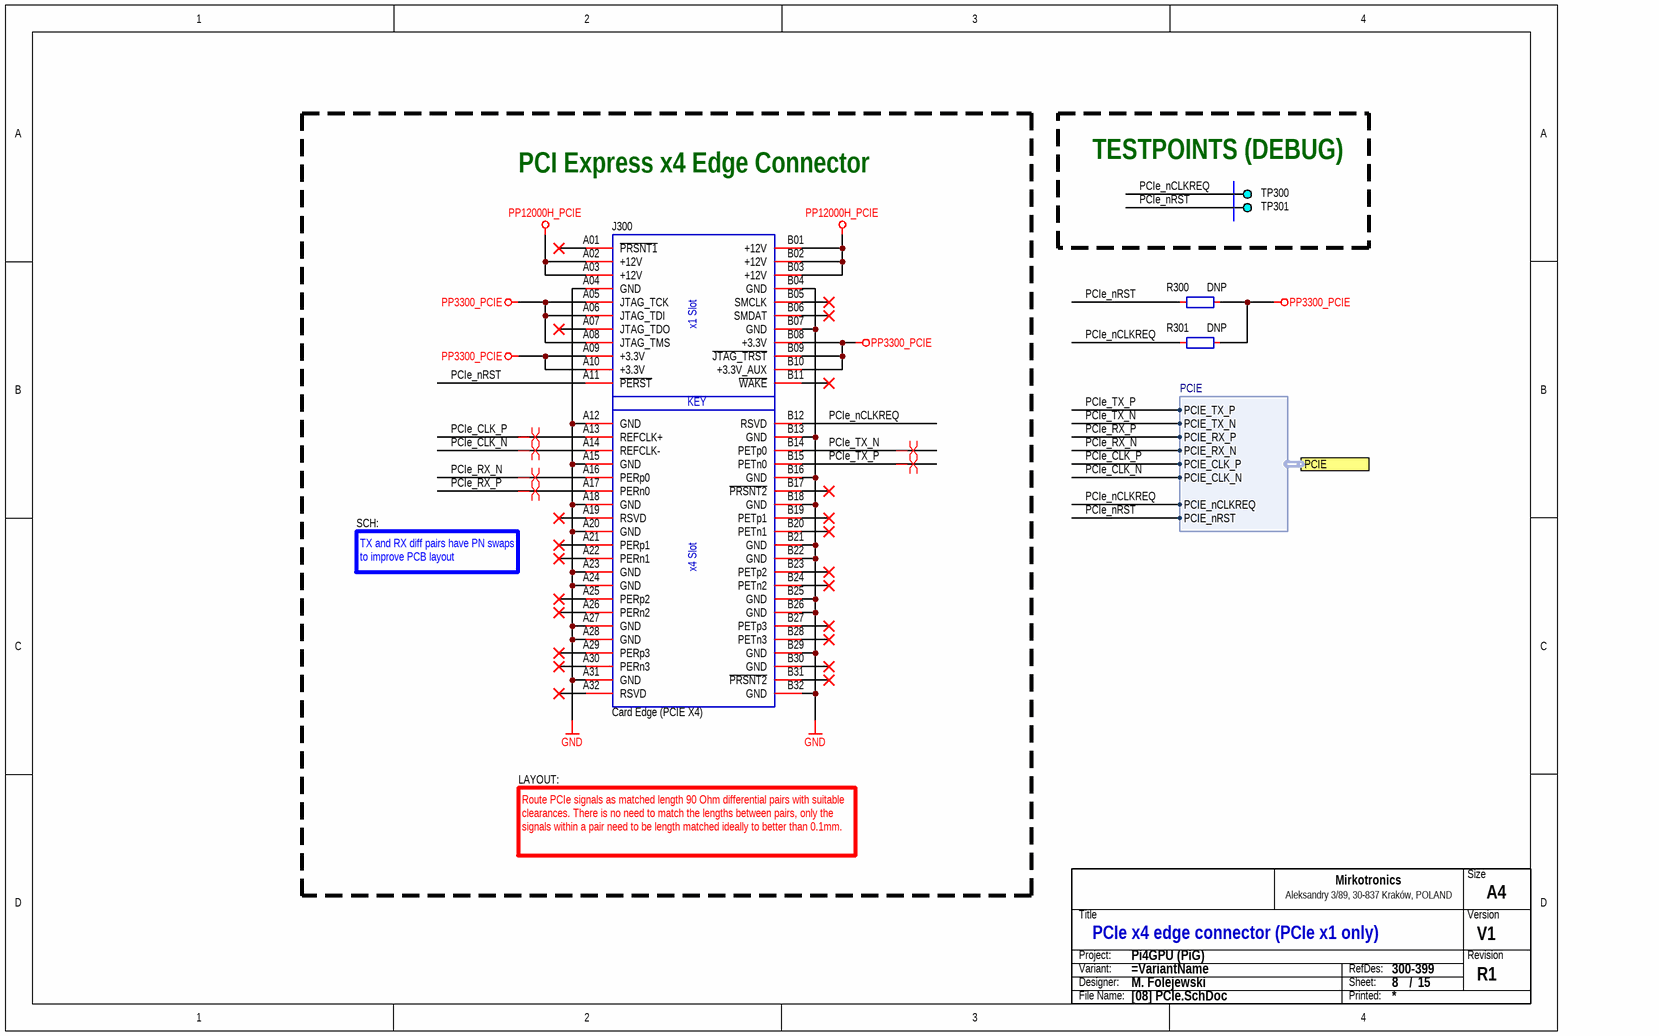
[diagram p5: [08] PCIe.SchDoc]

### Parts
(Parts that share a designator on the sheet are numbered #1, #2 ... from top to bottom, then left to right.)
J300  Card Edge (PCIE X4)  [PCB_CARD_EDGE_PCIE_64P]  (no BOM)
R300  DNP  [RES_0603_R]
R301  DNP  [RES_0603_R]
TB?#6  Title block  (value not drawn)  (graphical)
TP300  DEBUG  [PCB_TP_DBG_50]  (value not drawn)  (no BOM)
TP301  DEBUG  [PCB_TP_DBG_50]  (value not drawn)  (no BOM)

### Ports
PCIE (harness PCIE)

### Harnesses
PCIE: PCIE_TX_P, PCIE_TX_N, PCIE_RX_P, PCIE_RX_N, PCIE_CLK_P, PCIE_CLK_N, PCIE_nCLKREQ, PCIE_nRST

### Nets
GND: J300.A04(GND) J300.A12(GND) J300.A15(GND) J300.A18(GND) J300.A20(GND) J300.A23(GND) J300.A24(GND) J300.A27(GND) J300.A28(GND) J300.A31(GND) J300.B04(GND) J300.B07(GND) J300.B13(GND) J300.B16(GND) J300.B18(GND) J300.B21(GND) J300.B22(GND) J300.B25(GND) J300.B26(GND) J300.B29(GND) J300.B32(GND)
PP3300_PCIE: J300.A05(JTAG_TCK) J300.A06(JTAG_TDI) J300.A08(JTAG_TMS) J300.A09(+3.3V) J300.A10(+3.3V) J300.B08(+3.3V) J300.B09(~{JTAG_T}~{RST}) J300.B10(+3.3V_AUX) R300.1 R301.1
PP12000H_PCIE: J300.A02(+12V) J300.A03(+12V) J300.B01(+12V) J300.B02(+12V) J300.B03(+12V)
PCIe_CLK_N: J300.A14(REFCLK-) ; port PCIE.PCIE_CLK_N
PCIe_CLK_P: J300.A13(REFCLK+) ; port PCIE.PCIE_CLK_P
PCIe_nCLKREQ: J300.B12(RSVD) R301.2 TP300.1 ; port PCIE.PCIE_nCLKREQ
PCIe_nRST: J300.A11(~{PERST}) R300.2 TP301.1 ; port PCIE.PCIE_nRST
PCIe_RX_N: J300.A16(PERp0) ; port PCIE.PCIE_RX_N
PCIe_RX_P: J300.A17(PERn0) ; port PCIE.PCIE_RX_P
PCIe_TX_N: J300.B14(PETp0) ; port PCIE.PCIE_TX_N
PCIe_TX_P: J300.B15(PETn0) ; port PCIE.PCIE_TX_P

Not connected (* = marked no-connect by the designer): J300 A01(~{PRSNT1})* A07(JTAG_TDO)* A19(RSVD)* A21(PERp1)* A22(PERn1)* A25(PERp2)* A26(PERn2)* A29(PERp3)* A30(PERn3)* A32(RSVD)* B05(SMCLK)* B06(SMDAT)* B11(~{WAKE})* B17(~{PRSNT2})* B19(PETp1)* B20(PETn1)* B23(PETp2)* B24(PETn2)* B27(PETp3)* B28(PETn3)* B30(GND)* B31(~{PRSNT2})*

### Layout directives
differential pair: PCIe_CLK_N, PCIe_CLK_P, PCIe_RX_N, PCIe_RX_P, PCIe_TX_N, PCIe_TX_P

### Notes on the sheet
- PCI Express x4 Edge Connector
- TESTPOINTS (DEBUG)
- TX and RX diff pairs have PN swaps to improve PCB layout
- SCH:
- LAYOUT:
- Route PCIe signals as matched length 90 Ohm differential pairs with suitable clearances. There is no need to match the lengths between pairs, only the signals within a pair need to be length matched ideally to better than 0.1mm.
- (in symbol CON_PCIE_64P_VAR2) x1 Slot; KEY; x4 Slot
- (in symbol SCH_TITLE_BLOCK_MIRKOTRONICS_V2) Size; Mirkotronics; Aleksandry 3/89, 30-837 Kraków, POLAND; Title; Version; Project:; Revision; Variant:; RefDes:; Designer:; Sheet:; /; File Name:; Printed:

### Library data of the parts
J300 = CON_PCIE_64P_VAR2: Connector; PCIE, x4 (64pin); Value: Card Edge (PCIE X4); MPN: N/A; Manufacturer: N/A
R300 R301 = RES-0054: Resistor; Thick Film; GENERIC; TBD; TBD; TBD; TBD; TBD; SMD; 0603 (1608);; Component Type: Resistor; Component Subtype: Thick Film; Value: DNP; Manufacturer: GENERIC; MPN: GENERIC; Mounting Type: SMD; Package (Case): 0603 (1608); Supplier: ?
TB?#6 = SCH_TITLE_BLOCK_MIRKOTRONICS_V2: Component Type: Title block; Manufacturer: -; Mounting Type: Non component; MPN: -; Operating Temperature: -; Package: -; Specification: Title block; Value: Title block; Replacement: -; System: ?
TP300 TP301 = PCB_TP_DBG: PCB Marking; Test Point (Debug);; Value: DEBUG; Component Subtype: -; Component Type: Testpoint; Mounting Type: -; Supplier: ?

## Sheet [06] USB_C.SchDoc: USB-C interface and USB mux
size A4; Engineer: M. Folejewski; DocumentNumber: 6; SheetNumber: 6; SheetTotal: 15; PageSize: A4; Designators: 200-249
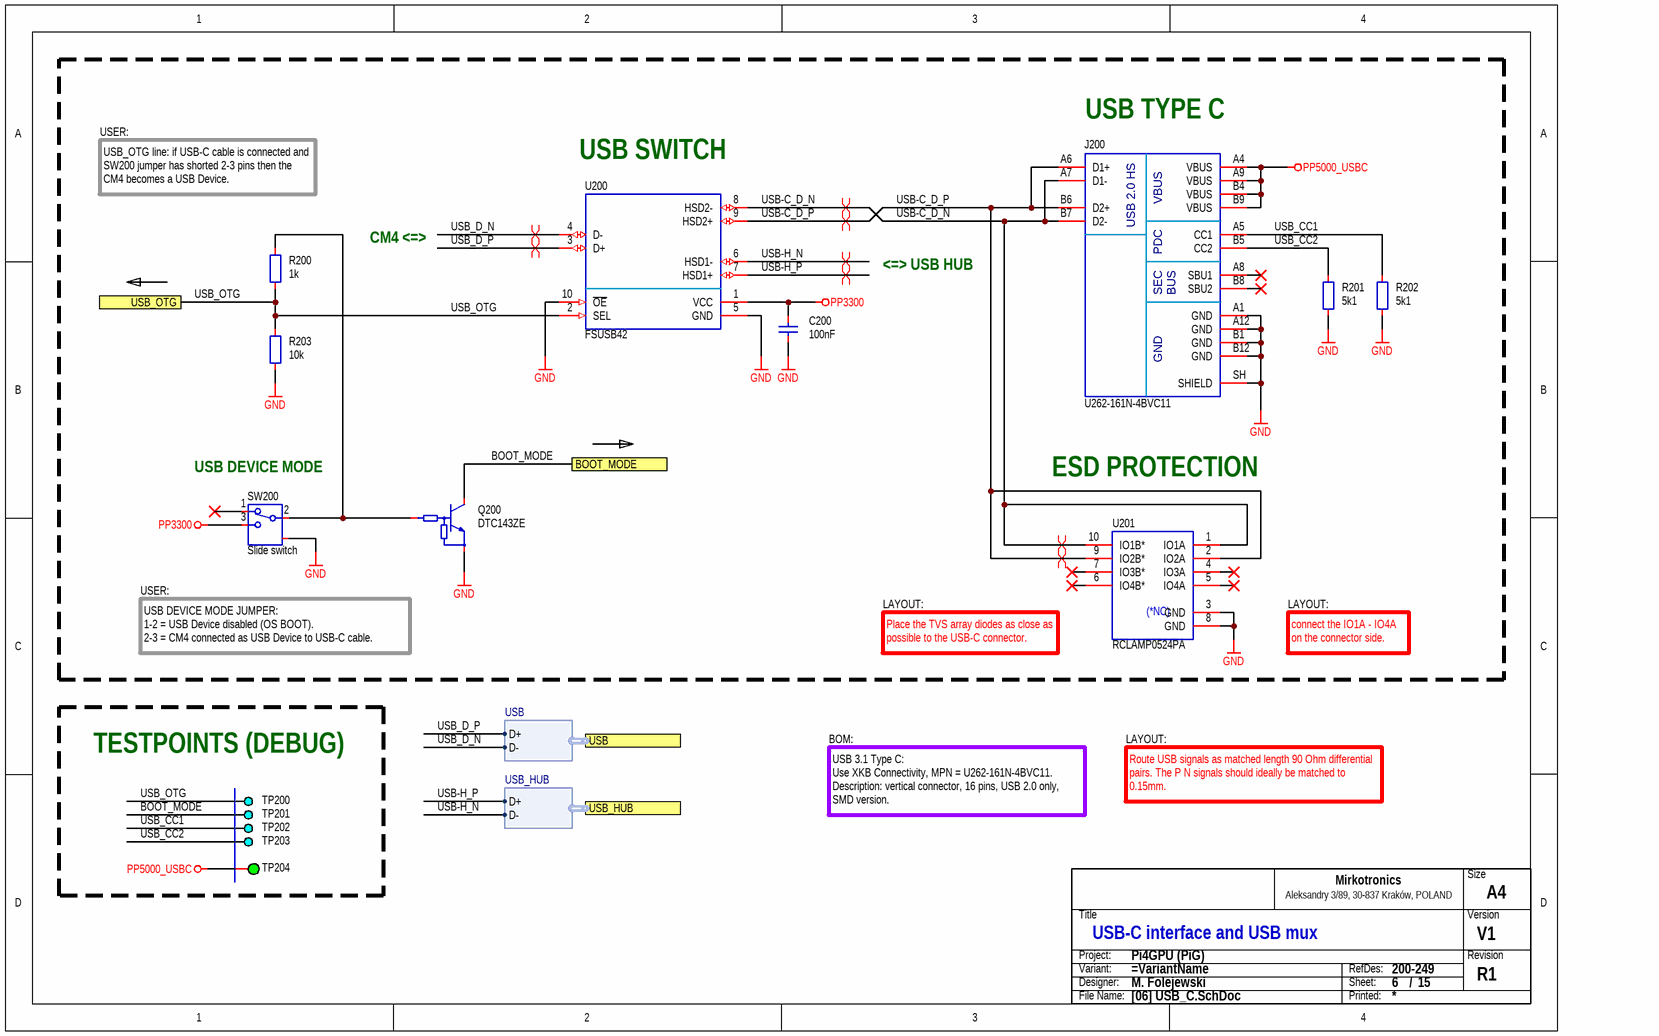
[diagram p6: [06] USB_C.SchDoc]

### Parts
(Parts that share a designator on the sheet are numbered #1, #2 ... from top to bottom, then left to right.)
C200  100nF  [CAP_0603_R]
J200  U262-161N-4BVC11  [CON_XKB_U262-161N-4BVC11]
Q200  DTC143ZE  [PKG_SOT523_SC75_SOT416_P100_R]
R200  1k  [RES_0603_R]
R201  5k1  [RES_0603_R]
R202  5k1  [RES_0603_R]
R203  10k  [RES_0603_R]
SW200  Slide switch  [SWI_XKB_SS-3292S-L1]
TB?#7  Title block  (value not drawn)  (graphical)
TP200  DEBUG  [PCB_TP_DBG_50]  (value not drawn)  (no BOM)
TP201  DEBUG  [PCB_TP_DBG_50]  (value not drawn)  (no BOM)
TP202  DEBUG  [PCB_TP_DBG_50]  (value not drawn)  (no BOM)
TP203  DEBUG  [PCB_TP_DBG_50]  (value not drawn)  (no BOM)
TP204  ICT  [PCB_TP_ICT_100]  (value not drawn)  (no BOM)
U200  FSUSB42  [ICC_MSOP10_300X300H110_P50_R]
U201  RCLAMP0524PA  [ICC_SLP2510P8_250X100X60_P50_R]

### Ports
BOOT_MODE, USB (harness USB), USB_HUB (harness USB_HUB), USB_OTG

### Harnesses
USB: D+, D-
USB_HUB: D+, D-

### Nets
GND: C200.1 J200.A1(GND) J200.A12(GND) J200.B1(GND) J200.B12(GND) J200.SH(SHIELD) Q200.2(E) R201.2 R202.2 R203.1 SW200.SH U200.5(GND) U200.10(~{OE}) U201.3(GND) U201.8(GND)
PP3300: C200.2 SW200.3 U200.1(VCC)
PP5000_USBC: J200.A4(VBUS) J200.A9(VBUS) J200.B4(VBUS) J200.B9(VBUS) TP204.1
BOOT_MODE: Q200.3(C) TP201.1 ; port BOOT_MODE
USB-C_D_N: J200.A7(D1-) J200.B7(D2-) U200.8(HSD2-) U201.1(IO1A) U201.10(IO1B*)
USB-C_D_P: J200.A6(D1+) J200.B6(D2+) U200.9(HSD2+) U201.2(IO2A) U201.9(IO2B*)
USB-H_N: U200.6(HSD1-) ; port USB_HUB.D-
USB-H_P: U200.7(HSD1+) ; port USB_HUB.D+
USB_CC1: J200.A5(CC1) R202.1 TP202.1
USB_CC2: J200.B5(CC2) R201.1 TP203.1
USB_D_N: U200.4(D-) ; port USB.D-  [project net CM_USB_D_N]
USB_D_P: U200.3(D+) ; port USB.D+  [project net CM_USB_D_P]
USB_OTG: R200.1 R203.2 TP200.1 U200.2(SEL) ; port USB_OTG  [project net CM_USB_OTG]
NetQ200_1: Q200.1(B) R200.2 SW200.2

Not connected (* = marked no-connect by the designer): J200 A8(SBU1)* B8(SBU2)*; SW200 1*; U201 4(IO3A)* 5(IO4A)* 6(IO4B*)* 7(IO3B*)*

### Layout directives
differential pair: CM_USB_D_N, CM_USB_D_P, USB-C_D_N, USB-C_D_P, USB-H_N, USB-H_P

### Notes on the sheet
- USER:
- (near U200) USB SWITCH
- (near J200) USB TYPE C
- USB_OTG line: if USB-C cable is connected and SW200 jumper has shorted 2-3 pins then the CM4 becomes a USB Device.
- CM4 <=>
- <=> USB HUB
- (near SW200) USB DEVICE MODE
- ESD PROTECTION
- USB DEVICE MODE JUMPER:
  1-2 = USB Device disabled (OS BOOT).
  2-3 = CM4 connected as USB Device to USB-C cable.
- Place the TVS array diodes as close as possible to the USB-C connector.
- LAYOUT:
- connect the IO1A - IO4A on the connector side.
- TESTPOINTS (DEBUG)
- BOM:
- USB 3.1 Type C:
  Use XKB Connectivity, MPN = U262-161N-4BVC11.
  Description: vertical connector, 16 pins, USB 2.0 only, SMD version.
- Route USB signals as matched length 90 Ohm differential pairs. The P N signals should ideally be matched to 0.15mm.
- (in symbol CON_USB_TYPE_C_16P) USB 2.0 HS; PDC; SEC; BUS
- (in symbol ICC-0005) (*NC)
- (in symbol SCH_TITLE_BLOCK_MIRKOTRONICS_V2) Size; Mirkotronics; Aleksandry 3/89, 30-837 Kraków, POLAND; Title; Version; Project:; Revision; Variant:; RefDes:; Designer:; Sheet:; /; File Name:; Printed:

### Library data of the parts
C200 = CAP-0008: Capacitor; MLCC; 100nF; TBD; TBD; TBD; TBD; SMD; 0603 (1608);; Component Type: Capacitor; Component Subtype: MLCC; Value: 100nF; Manufacturer: TBD; MPN: TBD; Mounting Type: SMD; Package (Case): 0603 (1608); Supplier: ?
J200 = CON_USB_TYPE_C_16P: Connector; USB 3.1 Type C; Receptacle; 24-pin; USB 2.0 Only;; Manufacturer: XKB Connectivity; Component Subtype: USB-C; Package (Case): SMD; Value: U262-161N-4BVC11; MPN: U262-161N-4BVC11; Component Type: Connector; Mounting Type: SMD; Supplier: ?
Q200 = TRA_BJT_NPN_DIG_BEC: Transistor; BJT; NPN; Digital;; Component Subtype: NPN Transistor; Value: DTC143ZE; MPN: DTC143ZE; Component Type: Transistor; Mounting Type: SMD; Supplier: ?
R200 = RES-0027: Resistor; Thick Film; 1k; 1%; 100mW; 100PPM; 75V; Standard; SMD; 0603 (1608);; Manufacturer: Yageo Corporation; MPN: TBD; Component Type: Resistor; Component Subtype: Thick Film; Value: 1k; Mounting Type: SMD; Package (Case): 0603 (1608); Supplier: ?
R201 R202 = RES-0043: Resistor; Thick Film; 5k1; 1%; 100mW; 100PPM; 75V; Standard; SMD; 0603 (1608);; Manufacturer: Yageo Corporation; MPN: TBD; Component Type: Resistor; Component Subtype: Thick Film; Value: 5k1; Mounting Type: SMD; Package (Case): 0603 (1608); Supplier: ?
R203 = RES-0028: as R103 on sheet [04] CM4_PART1; Component Type: Resistor; Component Subtype: Thick Film; Value: 10k; Mounting Type: SMD; Package (Case): 0603 (1608); Supplier: ?
SW200 = SWI_SPDT_3P_SH1: Switch; SPDT;; Manufacturer: XKB Connectivity; MPN: SS-3292S-L1; Package (Case): SMD; Component Subtype: Slide; Component Type: Switch; Mounting Type: SMD; Supplier: LCSC; Value: Slide switch
TB?#7 = SCH_TITLE_BLOCK_MIRKOTRONICS_V2: Component Type: Title block; Manufacturer: -; Mounting Type: Non component; MPN: -; Operating Temperature: -; Package: -; Specification: Title block; Value: Title block; Replacement: -; System: ?
TP200-TP203 = PCB_TP_DBG: PCB Marking; Test Point (Debug);; Value: DEBUG; Component Subtype: -; Component Type: Testpoint; Mounting Type: -; Supplier: ?
TP204 = PCB_TP_ICT: as TP112 on sheet [04] CM4_PART1; Component Type: Testpoint (for ICT); Manufacturer: -; Mounting Type: Non component; MPN: -; Value: ICT
U200 = ICC-0013: IC; USB Switch; TBD TBD; SMD; MSOP-10;; Manufacturer: ON Semiconductor; MPN: FSUSB42MUX; Component Type: IC; Component Subtype: USB Switch; Value: FSUSB42; Mounting Type: SMD; Package (Case): MSOP-10; Supplier: ?
U201 = ICC-0005: IC; TVS Arrays; ESD Protection; 4-Channel; 17kV Air; 12kV Contact; 0.3pF Capitance; TBD; SMD; TBD;; Manufacturer: Semtech Corporation; MPN: RCLAMP0524PATCT; Component Type: IC; Component Subtype: TVS Arrays; Value: RCLAMP0524PA; Mounting Type: SMD; Package (Case): TBD; Supplier: ?

## Sheet [10] Ethernet.SchDoc: 100/1000M Ethernet interface
size A4; Engineer: M. Folejewski; DocumentNumber: 10; SheetNumber: 10; SheetTotal: 15; PageSize: A4; Designators: 500-599
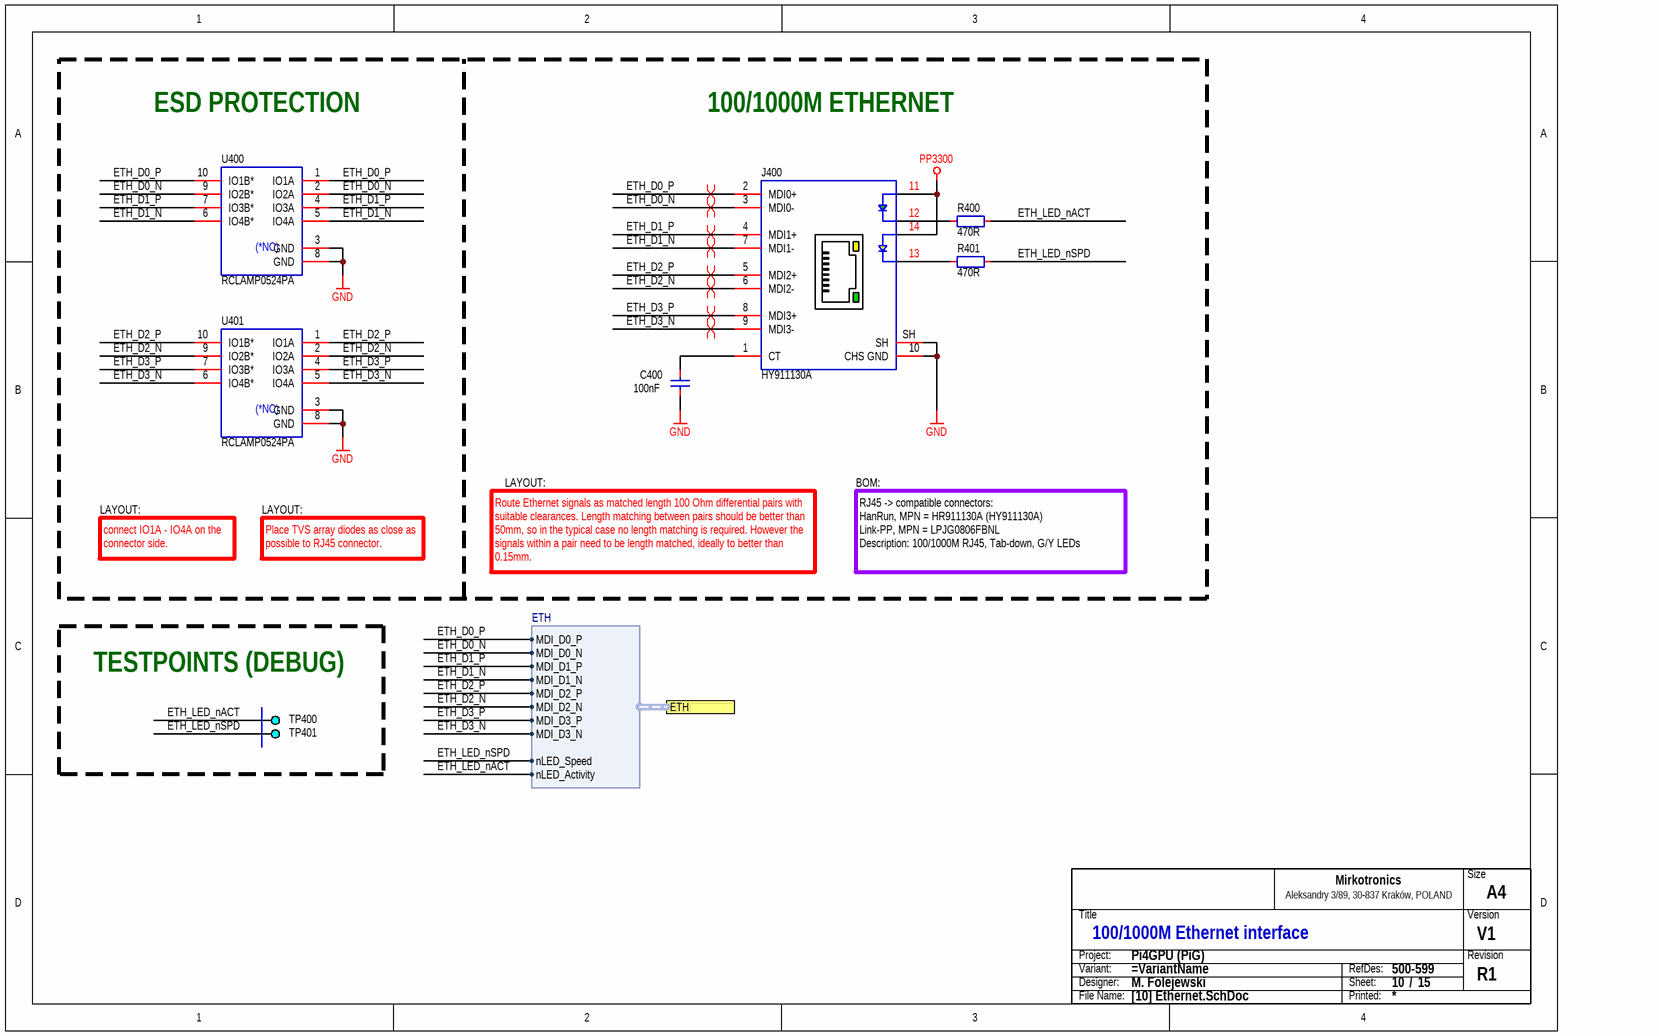
[diagram p7: [10] Ethernet.SchDoc]

### Parts
(Parts that share a designator on the sheet are numbered #1, #2 ... from top to bottom, then left to right.)
C400  100nF  [CAP_0603_R]
J400  HY911130A  [CON_WRT_7499110122]
R400  470R  [RES_0603_R]
R401  470R  [RES_0603_R]
TB?#8  Title block  (value not drawn)  (graphical)
TP400  DEBUG  [PCB_TP_DBG_50]  (value not drawn)  (no BOM)
TP401  DEBUG  [PCB_TP_DBG_50]  (value not drawn)  (no BOM)
U400  RCLAMP0524PA  [ICC_SLP2510P8_250X100X60_P50_R]
U401  RCLAMP0524PA  [ICC_SLP2510P8_250X100X60_P50_R]

### Ports
ETH (harness ETH)

### Harnesses
ETH: MDI_D0_P, MDI_D0_N, MDI_D1_P, MDI_D1_N, MDI_D2_P, MDI_D2_N, MDI_D3_P, MDI_D3_N, nLED_Speed, nLED_Activity

### Nets
GND: C400.1 J400.10(CHS_GND) J400.SH U400.3(GND) U400.8(GND) U401.3(GND) U401.8(GND)
PP3300: J400.11 J400.14
ETH_D0_N: J400.3(MDI0-) U400.2(IO2A) U400.9(IO2B*) ; port ETH.MDI_D0_N
ETH_D0_P: J400.2(MDI0+) U400.1(IO1A) U400.10(IO1B*) ; port ETH.MDI_D0_P
ETH_D1_N: J400.7(MDI1-) U400.5(IO4A) U400.6(IO4B*) ; port ETH.MDI_D1_N
ETH_D1_P: J400.4(MDI1+) U400.4(IO3A) U400.7(IO3B*) ; port ETH.MDI_D1_P
ETH_D2_N: J400.6(MDI2-) U401.2(IO2A) U401.9(IO2B*) ; port ETH.MDI_D2_N
ETH_D2_P: J400.5(MDI2+) U401.1(IO1A) U401.10(IO1B*) ; port ETH.MDI_D2_P
ETH_D3_N: J400.9(MDI3-) U401.5(IO4A) U401.6(IO4B*) ; port ETH.MDI_D3_N
ETH_D3_P: J400.8(MDI3+) U401.4(IO3A) U401.7(IO3B*) ; port ETH.MDI_D3_P
ETH_LED_nACT: R400.1 TP400.1 ; port ETH.nLED_Activity
ETH_LED_nSPD: R401.1 TP401.1 ; port ETH.nLED_Speed
NetC400_2: C400.2 J400.1(CT)
NetJ400_12: J400.12 R400.2
NetJ400_13: J400.13 R401.2

### Layout directives
differential pair: ETH_D0_N, ETH_D0_P, ETH_D1_N, ETH_D1_P, ETH_D2_N, ETH_D2_P, ETH_D3_N, ETH_D3_P

### Notes on the sheet
- ESD PROTECTION
- 100/1000M ETHERNET
- LAYOUT:
- BOM:
- connect IO1A - IO4A on the connector side.
- Place TVS array diodes as close as possible to RJ45 connector.
- Route Ethernet signals as matched length 100 Ohm differential pairs with suitable clearances. Length matching between pairs should be better than 50mm, so in the typical case no length matching is required. However the signals within a pair need to be length matched, ideally to better than 0.15mm.
- RJ45 -> compatible connectors:
  HanRun, MPN = HR911130A (HY911130A)
  Link-PP, MPN = LPJG0806FBNL
  Description: 100/1000M RJ45, Tab-down, G/Y LEDs
- TESTPOINTS (DEBUG)
- (in symbol ICC-0005) (*NC)
- (in symbol SCH_TITLE_BLOCK_MIRKOTRONICS_V2) Size; Mirkotronics; Aleksandry 3/89, 30-837 Kraków, POLAND; Title; Version; Project:; Revision; Variant:; RefDes:; Designer:; Sheet:; /; File Name:; Printed:

### Library data of the parts
C400 = CAP-0008: as C200 on sheet [06] USB_C; Component Type: Capacitor; Component Subtype: MLCC; Value: 100nF; Manufacturer: TBD; MPN: TBD; Mounting Type: SMD; Package (Case): 0603 (1608); Supplier: ?
J400 = CON_HAN_HY911130A: Connector; RJ45;; Manufacturer: HanRun; MPN: HY911130A; Value: HY911130A; Component Subtype: RJ45; Component Type: Connector; Mounting Type: THT; Supplier: ?
R400 R401 = RES-0042: Resistor; Thick Film; 470R; 1%; 100mW; 100PPM; 75V; Standard; SMD; 0603 (1608);; Manufacturer: Yageo Corporation; MPN: TBD; Component Type: Resistor; Component Subtype: Thick Film; Value: 470R; Mounting Type: SMD; Package (Case): 0603 (1608); Supplier: ?
TB?#8 = SCH_TITLE_BLOCK_MIRKOTRONICS_V2: Component Type: Title block; Manufacturer: -; Mounting Type: Non component; MPN: -; Operating Temperature: -; Package: -; Specification: Title block; Value: Title block; Replacement: -; System: ?
TP400 TP401 = PCB_TP_DBG: PCB Marking; Test Point (Debug);; Value: DEBUG; Component Subtype: -; Component Type: Testpoint; Mounting Type: -; Supplier: ?
U400 U401 = ICC-0005: as U201 on sheet [06] USB_C; Component Type: IC; Component Subtype: TVS Arrays; Value: RCLAMP0524PA; Mounting Type: SMD; Package (Case): TBD; Supplier: ?

## Sheet [11] SD.SchDoc: MicroSD slot
size A4; Engineer: M. Folejewski; DocumentNumber: 11; SheetNumber: 11; SheetTotal: 15; PageSize: A4; Designators: 600-699
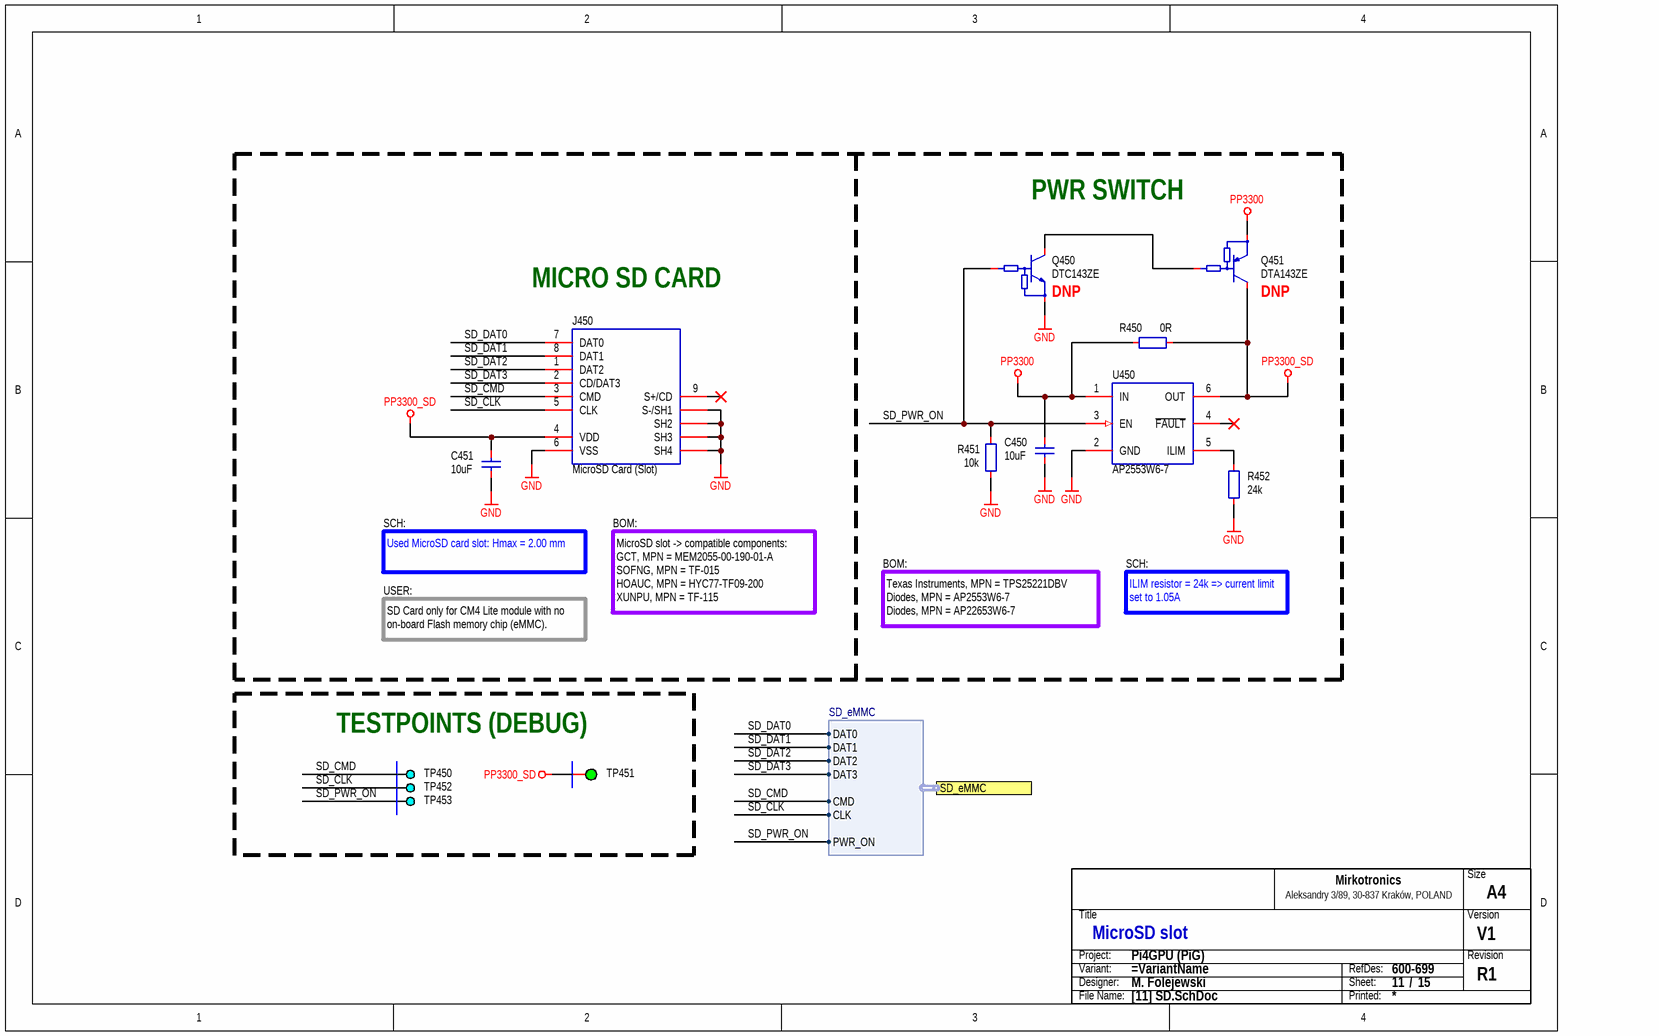
[diagram p8: [11] SD.SchDoc]

### Parts
(Parts that share a designator on the sheet are numbered #1, #2 ... from top to bottom, then left to right.)
C450  10uF  [CAP_0603_R]
C451  10uF  [CAP_0603_R]
J450  MicroSD Card (Slot)  [CON_GCT_MEM2055_R]
Q450  DTC143ZE  [PKG_SOT523_SC75_SOT416_P100_R]
Q451  DTA143ZE  [PKG_SOT523_SC75_SOT416_P100_R]
R450  0R  [RES_0603_R]
R451  10k  [RES_0603_R]
R452  24k  [RES_0603_R]
TB?#9  Title block  (value not drawn)  (graphical)
TP450  DEBUG  [PCB_TP_DBG_50]  (value not drawn)  (no BOM)
TP451  ICT  [PCB_TP_ICT_100]  (value not drawn)  (no BOM)
TP452  DEBUG  [PCB_TP_DBG_50]  (value not drawn)  (no BOM)
TP453  DEBUG  [PCB_TP_DBG_50]  (value not drawn)  (no BOM)
U450  AP2553W6-7  [PKG_SOT23-6]

### Ports
SD_eMMC (harness SD_eMMC)

### Harnesses
SD_eMMC: DAT0, DAT1, DAT2, DAT3, CMD, CLK, PWR_ON

### Nets
GND: C450.1 C451.1 J450.6(VSS) J450.SH1(S-/SH1) J450.SH2 J450.SH3 J450.SH4 Q450.2(E) R451.1 R452.1 U450.2(GND)
PP3300: C450.2 Q451.2(E) R450.2 U450.1(IN)
PP3300_SD: C451.2 J450.4(VDD) Q451.3(C) R450.1 TP451.1 U450.6(OUT)
SD_CLK: J450.5(CLK) TP452.1 ; port SD_eMMC.CLK  [project net CM_SD_CLK]
SD_CMD: J450.3(CMD) TP450.1 ; port SD_eMMC.CMD  [project net CM_SD_CMD]
SD_DAT0: J450.7(DAT0) ; port SD_eMMC.DAT0  [project net CM_SD_DAT0]
SD_DAT1: J450.8(DAT1) ; port SD_eMMC.DAT1  [project net CM_SD_DAT1]
SD_DAT2: J450.1(DAT2) ; port SD_eMMC.DAT2  [project net CM_SD_DAT2]
SD_DAT3: J450.2(CD/DAT3) ; port SD_eMMC.DAT3  [project net CM_SD_DAT3]
SD_PWR_ON: Q450.1(B) R451.2 TP453.1 U450.3(EN) ; port SD_eMMC.PWR_ON  [project net CM_SD_PWR_ON]
NetQ450_3: Q450.3(C) Q451.1(B)
NetR452_2: R452.2 U450.5(ILIM)

Not connected (* = marked no-connect by the designer): J450 9(S+/CD)*; U450 4(~{FAULT})*

### Notes on the sheet
- PWR SWITCH
- (near J450) MICRO SD CARD
- (near Q450) DNP
- (near Q451) DNP
- Used MicroSD card slot: Hmax = 2.00 mm
- SCH:
- BOM:
- SD Card only for CM4 Lite module with no on-board Flash memory chip (eMMC).
- USER:
- MicroSD slot -> compatible components:
  GCT, MPN = MEM2055-00-190-01-A
  SOFNG, MPN = TF-015
  HOAUC, MPN = HYC77-TF09-200
  XUNPU, MPN = TF-115
- Texas Instruments, MPN = TPS25221DBV
  Diodes, MPN = AP2553W6-7
  Diodes, MPN = AP22653W6-7
- ILIM resistor = 24k => current limit set to 1.05A
- TESTPOINTS (DEBUG)
- (in symbol SCH_TITLE_BLOCK_MIRKOTRONICS_V2) Size; Mirkotronics; Aleksandry 3/89, 30-837 Kraków, POLAND; Title; Version; Project:; Revision; Variant:; RefDes:; Designer:; Sheet:; /; File Name:; Printed:

### Library data of the parts
C450 C451 = CAP-0023: Capacitor; MLCC; GENERIC; TBD; TBD; TBD; TBD; SMD; 0603 (1608);; Component Type: Capacitor; Component Subtype: MLCC; Value: 10uF; Manufacturer: GENERIC; MPN: GENERIC; Mounting Type: SMD; Package (Case): 0603 (1608); Supplier: ?
J450 = CON_GCT_MEM2055: Connector; MicroSD Card Connector;; Manufacturer: TF-015; Package (Case): SMD; MPN: TF-015; Value: MicroSD Card (Slot); Component Subtype: MicroSD Card; Component Type: Card Socket; Mounting Type: SMD; Supplier: ?
Q450 = TRA_BJT_NPN_DIG_BEC: as Q200 on sheet [06] USB_C; Value: DTC143ZE; MPN: DTC143ZE; Component Type: Transistor; Mounting Type: SMD; Supplier: ?
Q451 = TRA_BJT_PNP_DIG_ONS_DTA143ZE: as Q100 on sheet [04] CM4_PART1; Component Type: Transistor; Mounting Type: SMD; Value: DTA143ZE
R450 R452 = RES-0054: as R300 on sheet [08] PCIe; Component Type: Resistor; Component Subtype: Thick Film; Manufacturer: GENERIC; MPN: GENERIC; Mounting Type: SMD; Package (Case): 0603 (1608); Supplier: ?
  R450: Value: 0R
  R452: Value: 24k
R451 = RES-0028: as R103 on sheet [04] CM4_PART1; Component Type: Resistor; Component Subtype: Thick Film; Value: 10k; Mounting Type: SMD; Package (Case): 0603 (1608); Supplier: ?
TB?#9 = SCH_TITLE_BLOCK_MIRKOTRONICS_V2: Component Type: Title block; Manufacturer: -; Mounting Type: Non component; MPN: -; Operating Temperature: -; Package: -; Specification: Title block; Value: Title block; Replacement: -; System: ?
TP450 TP452 TP453 = PCB_TP_DBG: PCB Marking; Test Point (Debug);; Value: DEBUG; Component Subtype: -; Component Type: Testpoint; Mounting Type: -; Supplier: ?
TP451 = PCB_TP_ICT: as TP112 on sheet [04] CM4_PART1; Component Type: Testpoint (for ICT); Manufacturer: -; Mounting Type: Non component; MPN: -; Value: ICT
U450 = ICC_TXI_TPS25221_DBV: IC; Current Limited Switch;; Manufacturer: Diodes Incorporated; Package (Case): SOT26; MPN: AP2553W6-7; Value: AP2553W6-7; Component Subtype: Current Limited Switch; Component Type: IC; Mounting Type: SMD; Supplier: ?

## Sheet [16] PCB_Mech.SchDoc: PCB marking & mechanical parts
size A4; Engineer: M. Folejewski; DocumentNumber: 14; SheetNumber: 14; SheetTotal: 15; PageSize: A4; Designators: 950-999
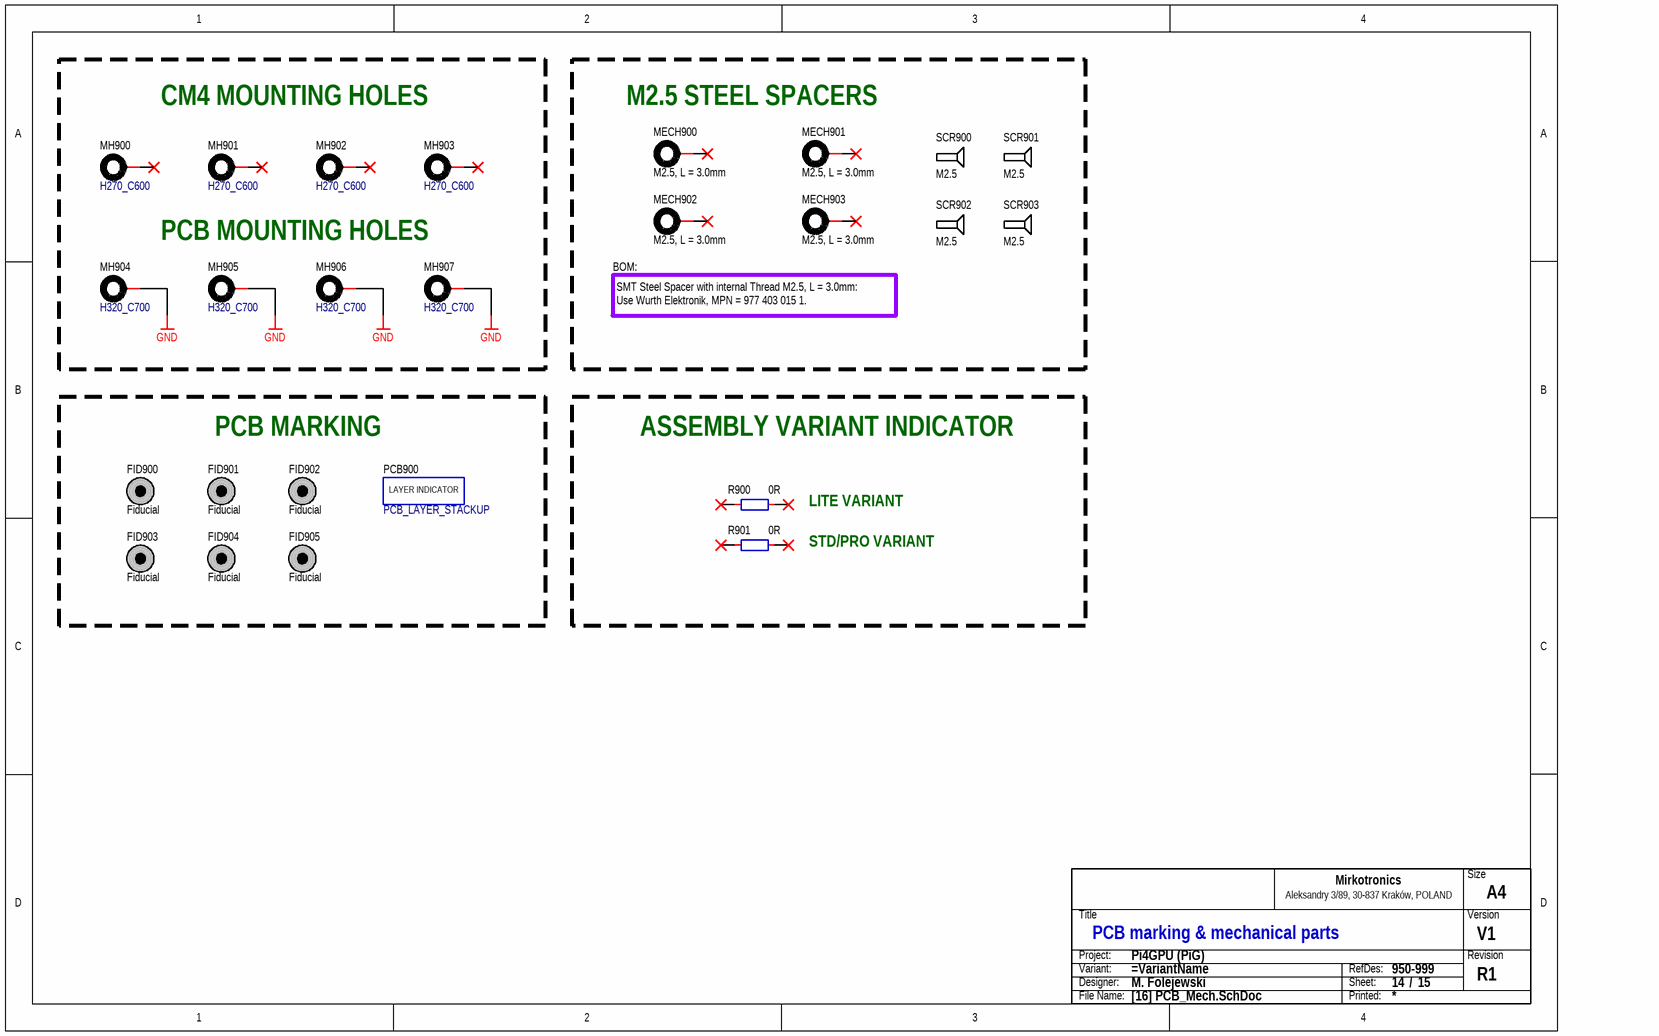
[diagram p9: [16] PCB_Mech.SchDoc]

### Parts
(Parts that share a designator on the sheet are numbered #1, #2 ... from top to bottom, then left to right.)
FID900  Fiducial  [PCB_FID_RND_100x300]  (no BOM)
FID901  Fiducial  [PCB_FID_RND_100x300]  (no BOM)
FID902  Fiducial  [PCB_FID_RND_100x300]  (no BOM)
FID903  Fiducial  [PCB_FID_RND_100x300]  (no BOM)
FID904  Fiducial  [PCB_FID_RND_100x300]  (no BOM)
FID905  Fiducial  [PCB_FID_RND_100x300]  (no BOM)
MECH900  M2.5, L = 3.0mm  [PCB_WRT_9774030151]
MECH901  M2.5, L = 3.0mm  [PCB_WRT_9774030151]
MECH902  M2.5, L = 3.0mm  [PCB_WRT_9774030151]
MECH903  M2.5, L = 3.0mm  [PCB_WRT_9774030151]
MH900  H270_C600  [PCB_MH_H270_C600]  (no BOM)
MH901  H270_C600  [PCB_MH_H270_C600]  (no BOM)
MH902  H270_C600  [PCB_MH_H270_C600]  (no BOM)
MH903  H270_C600  [PCB_MH_H270_C600]  (no BOM)
MH904  H320_C700  [PCB_MH_H320_C700]  (no BOM)
MH905  H320_C700  [PCB_MH_H320_C700]  (no BOM)
MH906  H320_C700  [PCB_MH_H320_C700]  (no BOM)
MH907  H320_C700  [PCB_MH_H320_C700]  (no BOM)
PCB900  PCB_LAYER_STACKUP  [PCB_STACKUP-4L]  (no BOM)
R900  0R  [RES_0805_R]
R901  0R  [RES_0805_R]
SCR900  M2.5  (mechanical)
SCR901  M2.5  (mechanical)
SCR902  M2.5  (mechanical)
SCR903  M2.5  (mechanical)
TB?#10  Title block  (value not drawn)  (graphical)

### Nets
GND: MH904.MH MH905.MH MH906.MH MH907.MH

Not connected (* = marked no-connect by the designer): MECH900 1*; MECH901 1*; MECH902 1*; MECH903 1*; MH900 1*; MH901 1*; MH902 1*; MH903 1*; R900 1* 2*; R901 1* 2*

### Notes on the sheet
- CM4 MOUNTING HOLES
- M2.5 STEEL SPACERS
- PCB MOUNTING HOLES
- SMT Steel Spacer with internal Thread M2.5, L = 3.0mm:
  Use Wurth Elektronik, MPN = 977 403 015 1.
- BOM:
- PCB MARKING
- ASSEMBLY VARIANT INDICATOR
- LITE VARIANT
- STD/PRO VARIANT
- (in symbol PCB_LAYER_STACKUP) LAYER INDICATOR
- (in symbol SCH_TITLE_BLOCK_MIRKOTRONICS_V2) Size; Mirkotronics; Aleksandry 3/89, 30-837 Kraków, POLAND; Title; Version; Project:; Revision; Variant:; RefDes:; Designer:; Sheet:; /; File Name:; Printed:

### Library data of the parts
FID900-FID905 = PCB_FID_RND: PCB Marking; Fiducial; Round;; Value: Fiducial; Component Subtype: -; Component Type: Fiducial; Mounting Type: -; Supplier: ?
MECH900-MECH903 = PCB_MECH_WRT_WA-SMSI: PCB; Mechanical; SMT Steel Spacer; M2.5;; Manufacturer: Wurth Elektronik; MPN: 977 403 015 1; Component Subtype: SMD Spacer; Package (Case): SMD; Value: M2.5, L = 3.0mm; Component Type: Spacer (Standoff); Mounting Type: SMD; Supplier: Wurth Elektronik
MH900-MH907 = PCB_MECH_MH: PCB Marking; Mounting hole;; Component Subtype: -; Component Type: Mounting Hole; Mounting Type: -; Supplier: ?
  MH900-MH903: Value: H270_C600
  MH904-MH907: Value: H320_C700
R900 R901 = RES-0047: Resistor; Thick Film; 0R; 1%; TBD; TBD; TBD; Standard; SMD; 0805 (2012);; ID: RES-0047; Component Type: Resistor; Component Subtype: Thick Film; Value: 0R; Manufacturer: TBD; MPN: TBD; Mounting Type: SMD; Package (Case): 0805 (2012); Component Body: TBD; Component Height: TBD; Packaging Type: TBD; ROHS Status: TBD; Operating Temperature: TBD; Resistance: 0R; Tolerance: 1%; Power Rating: TBD; TCR: TBD; Voltage Rating: TBD; Features: Standard
SCR900-SCR903 = PCB_MECH_SCR: Mechnical; Screw;; MPN: M2.5 screw; Manufacturer: *; Value: M2.5
TB?#10 = SCH_TITLE_BLOCK_MIRKOTRONICS_V2: Component Type: Title block; Manufacturer: -; Mounting Type: Non component; MPN: -; Operating Temperature: -; Package: -; Specification: Title block; Value: Title block; Replacement: -; System: ?
PCB900 = PCB_LAYER_STACKUP: Component Subtype: -; Component Type: PCB Marking; Mounting Type: -; Supplier: ?